# EAGLE board PDNode-600 Pro1 (EAGLE 9.2.1), part 1 of 5
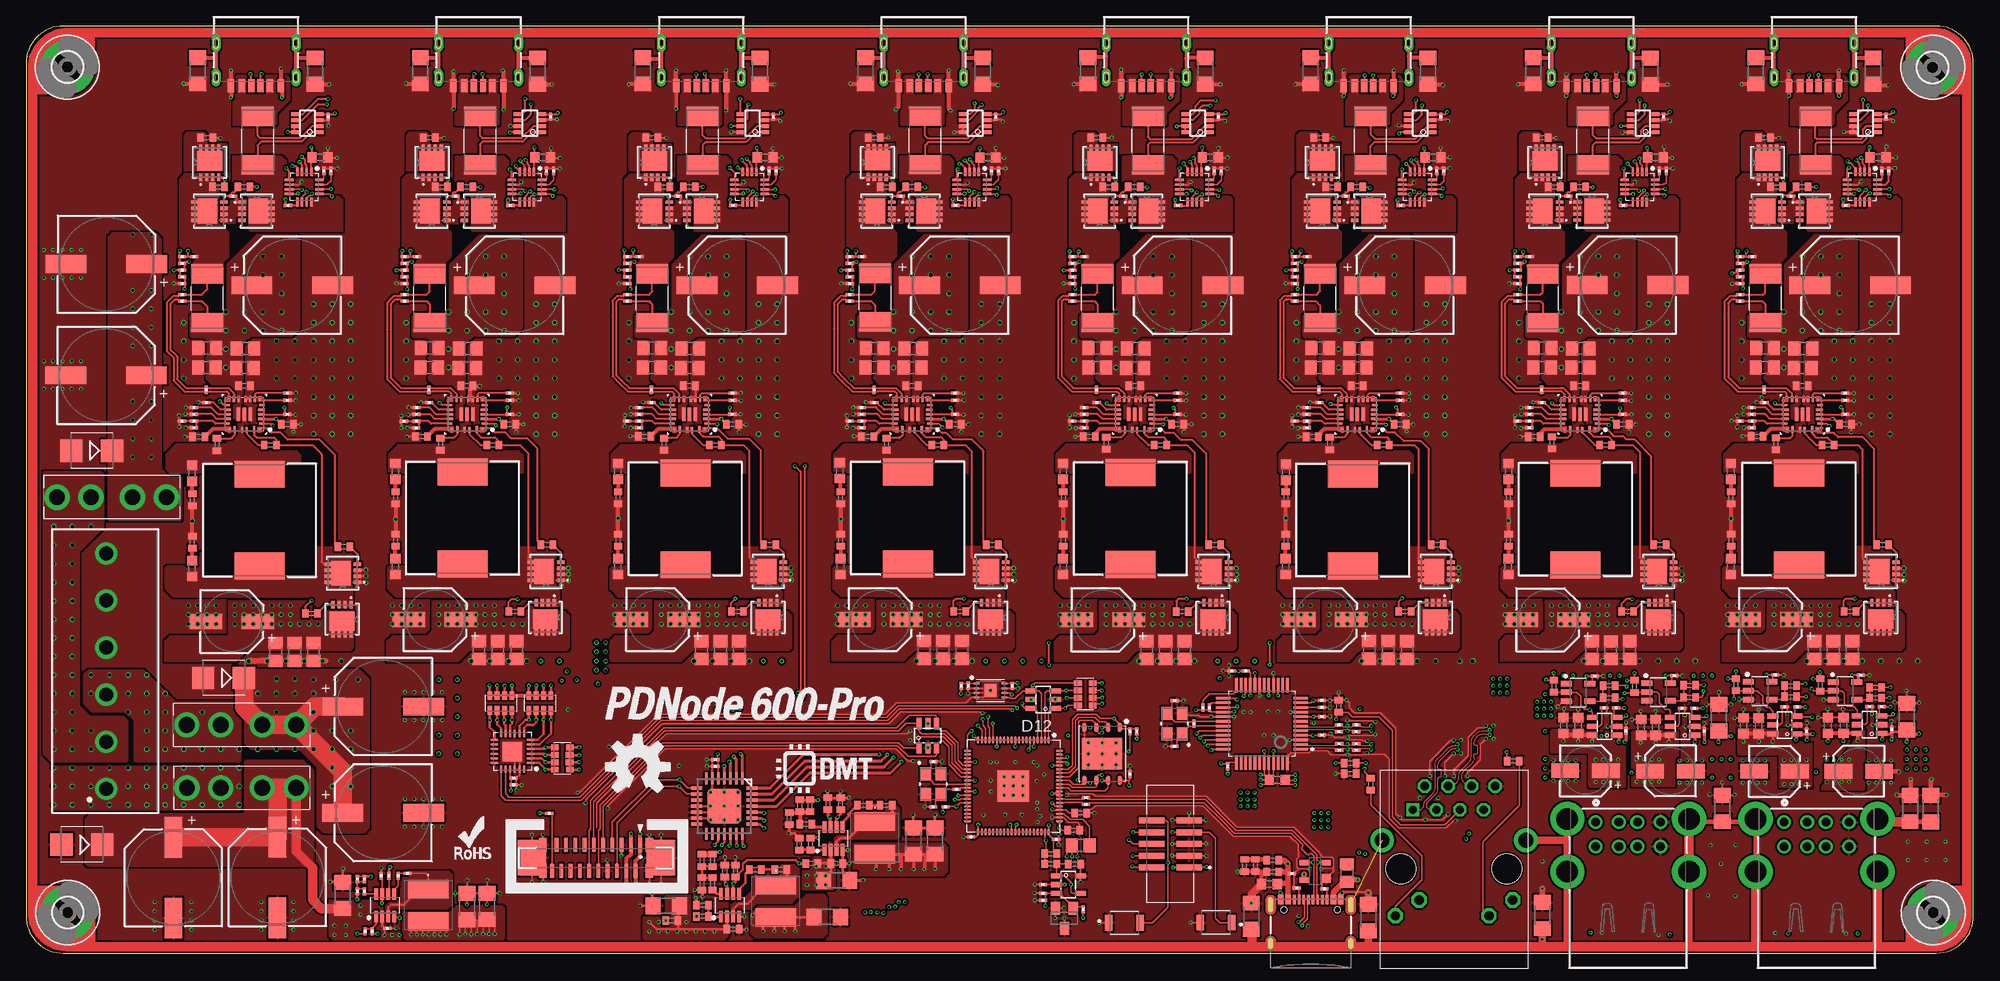
[diagram p15: board, top side]
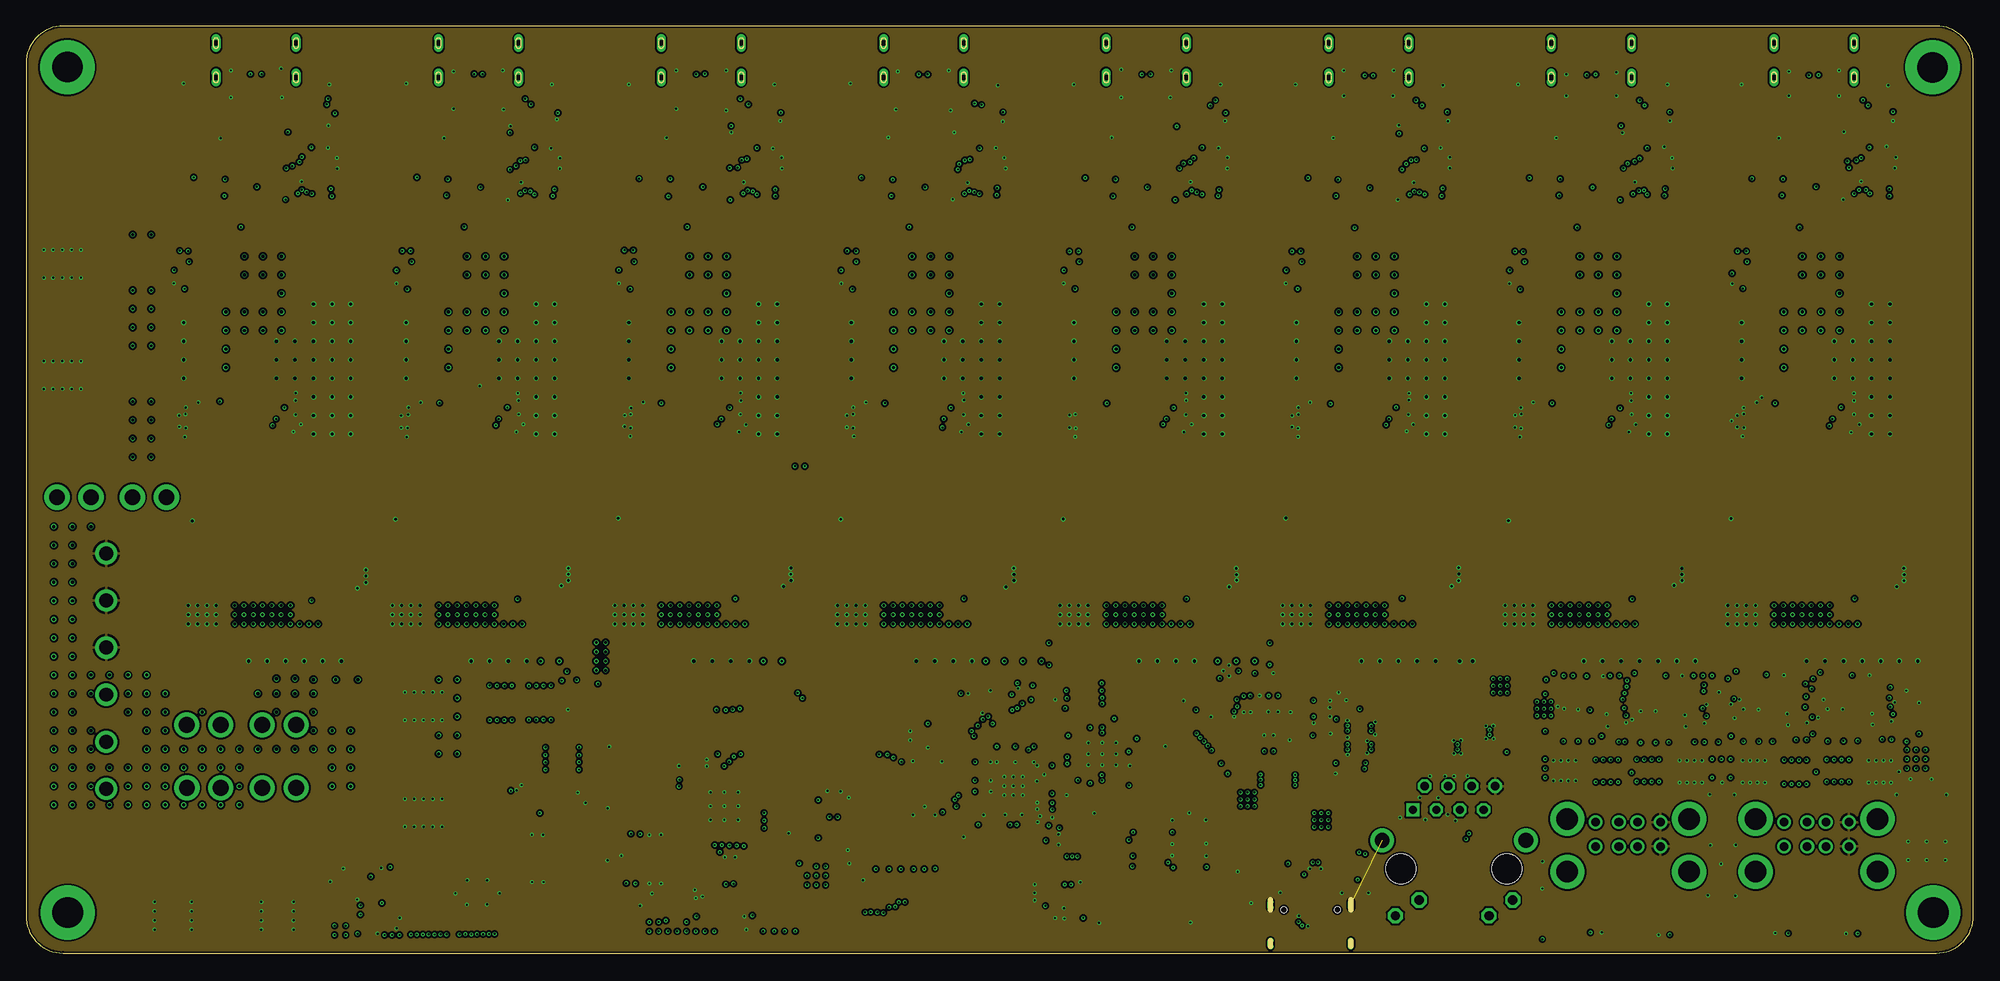
[diagram p16: board, inner layer L2-GND]
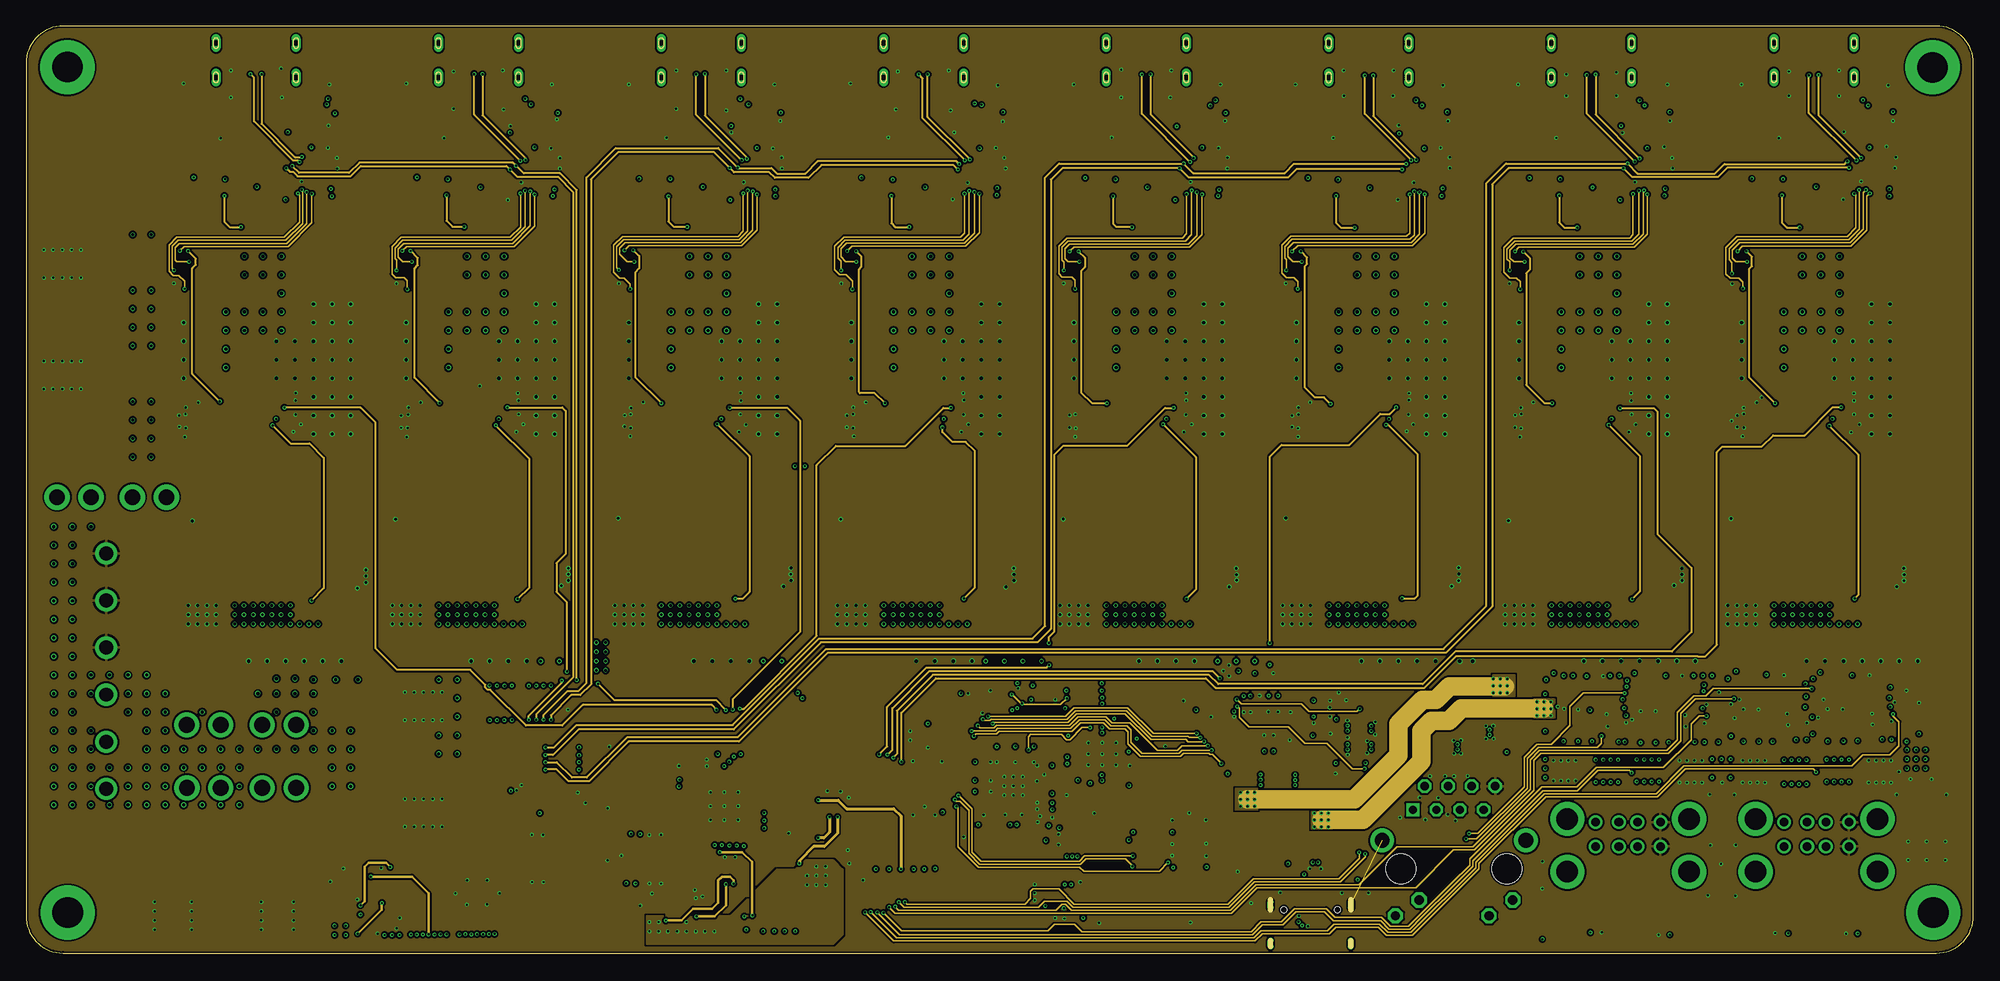
[diagram p17: board, inner layer L3-SIG-LS]
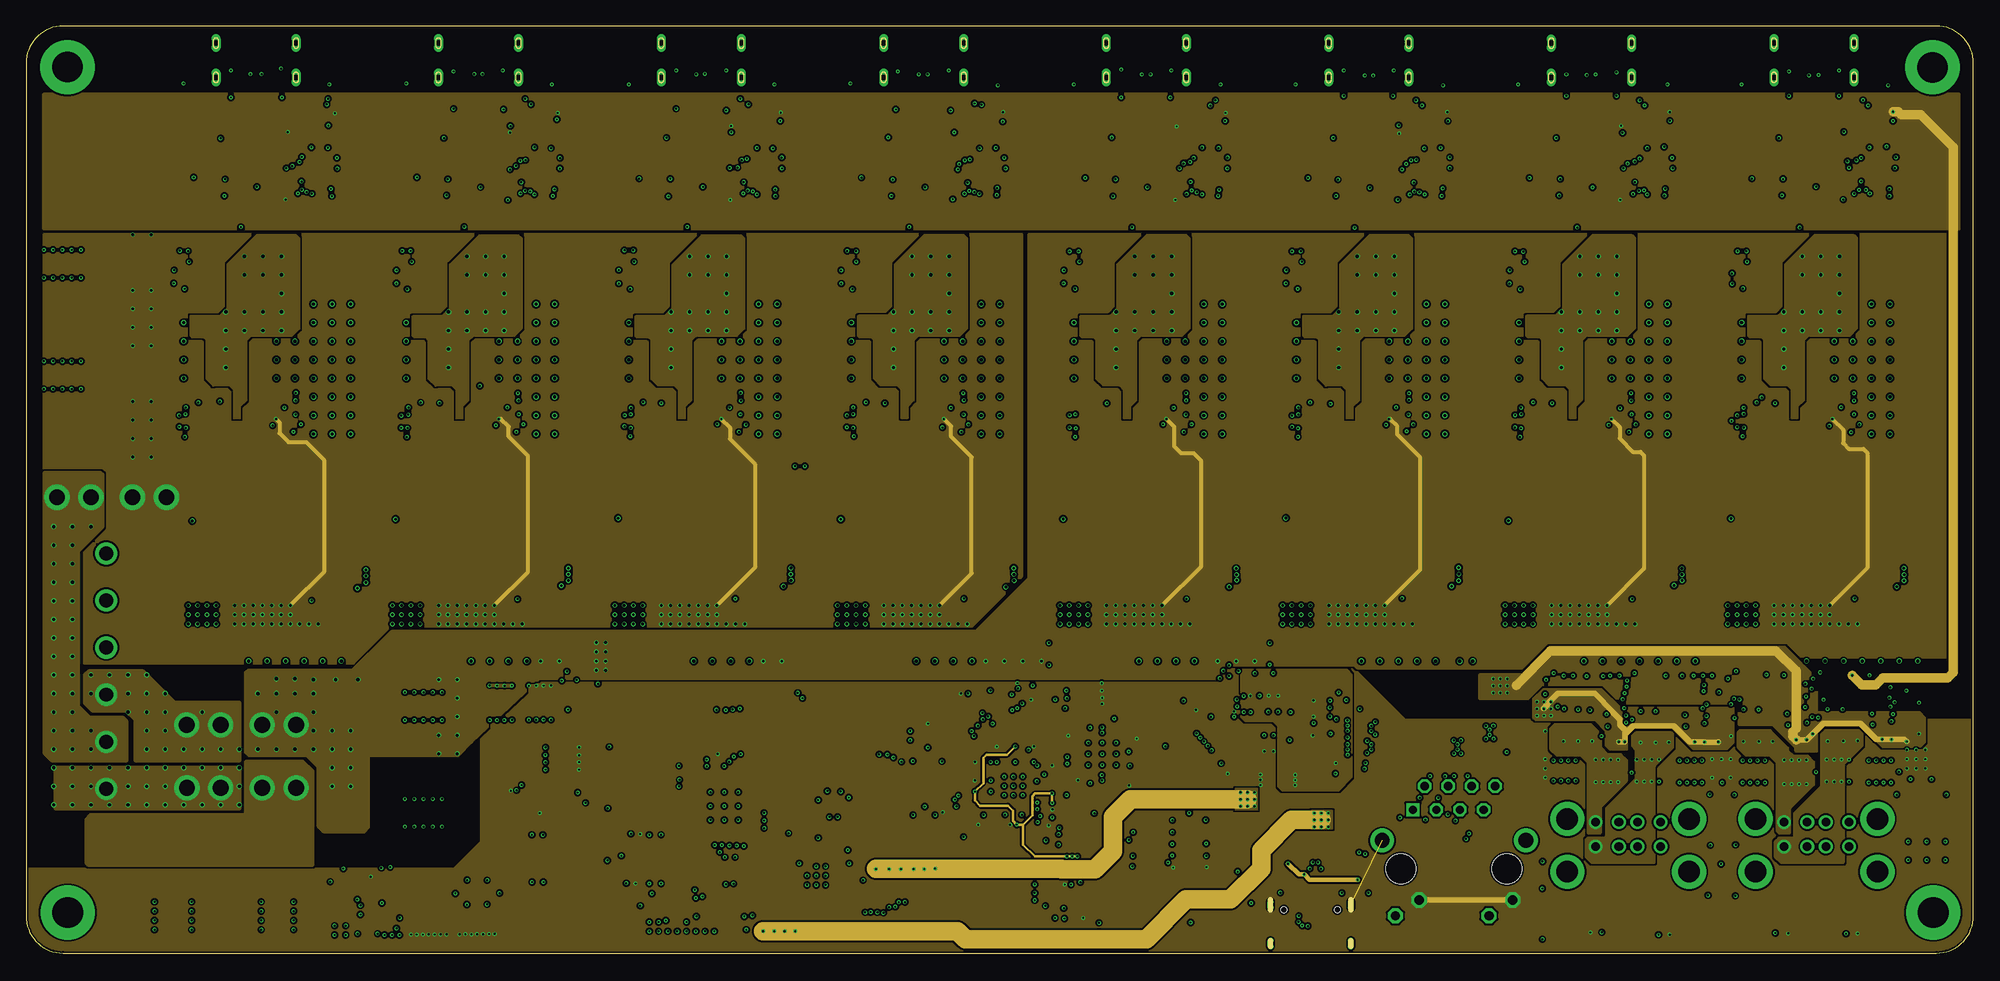
[diagram p18: board, inner layer L4-PWR]
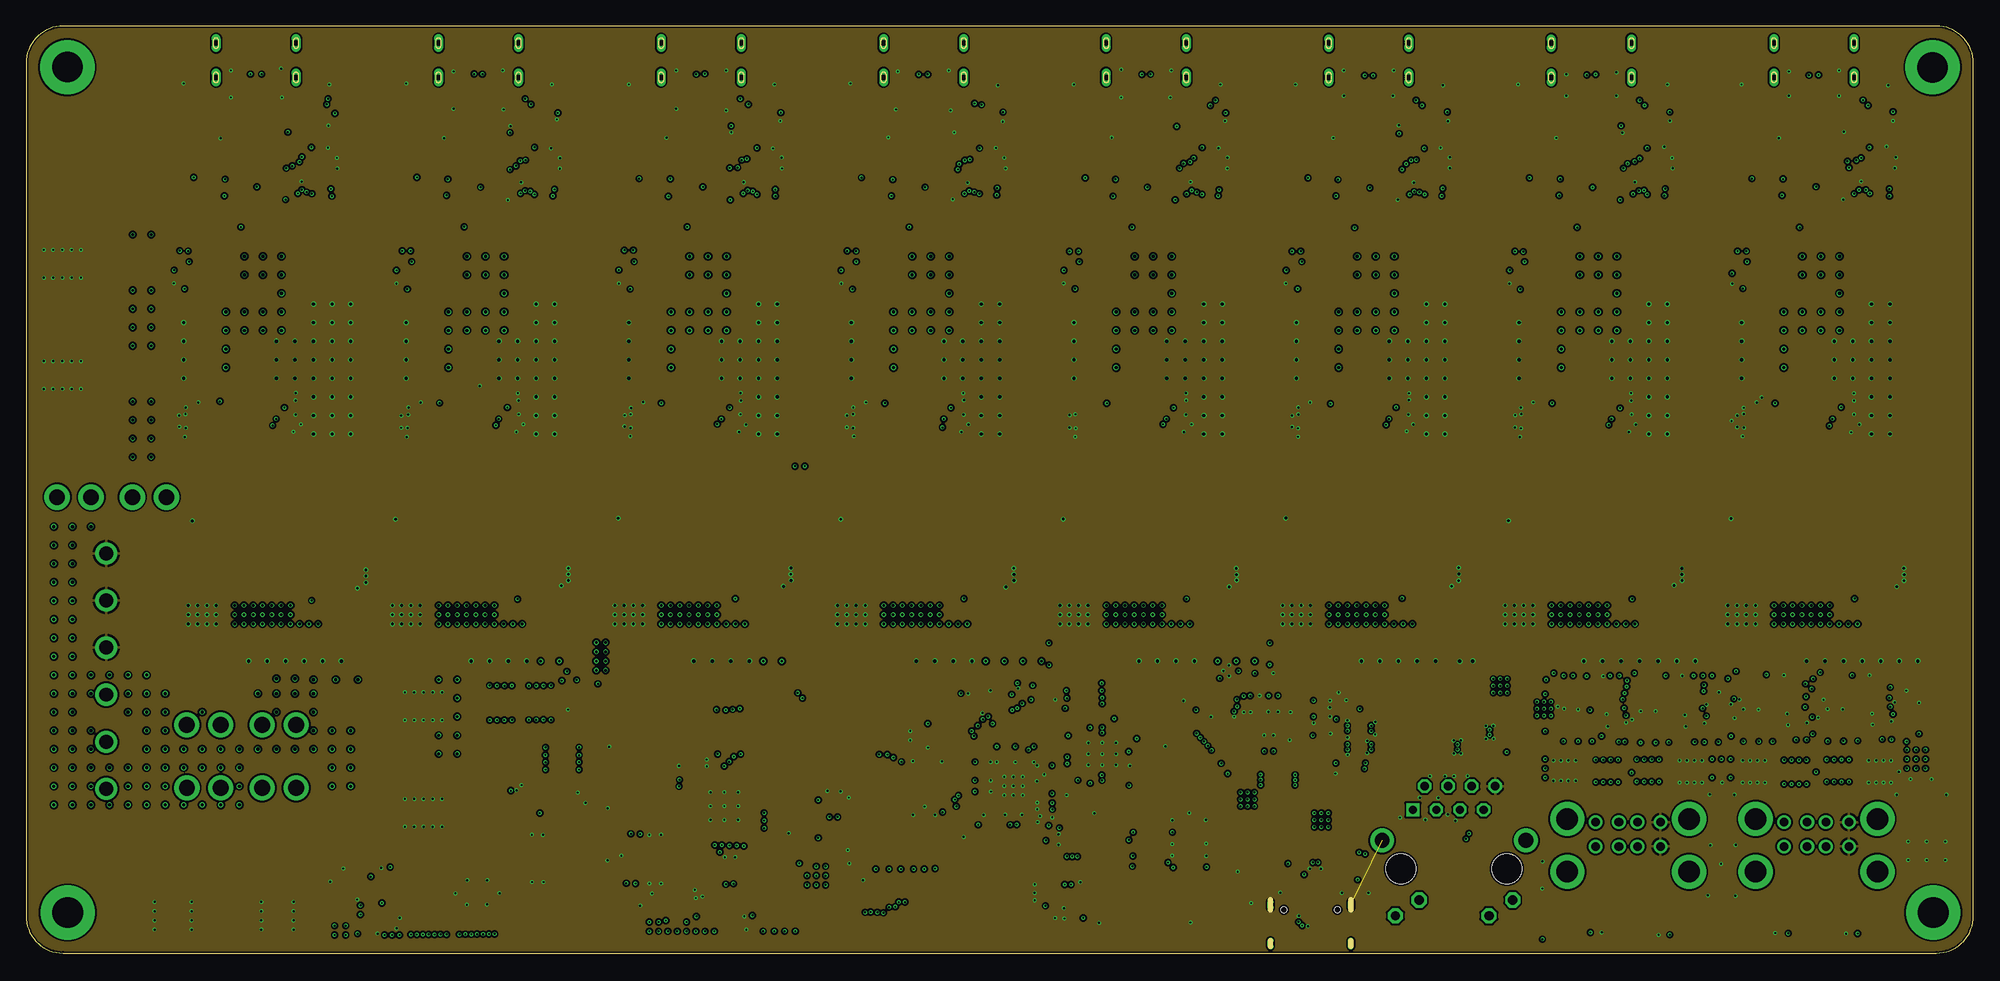
[diagram p19: board, inner layer L5-GND]
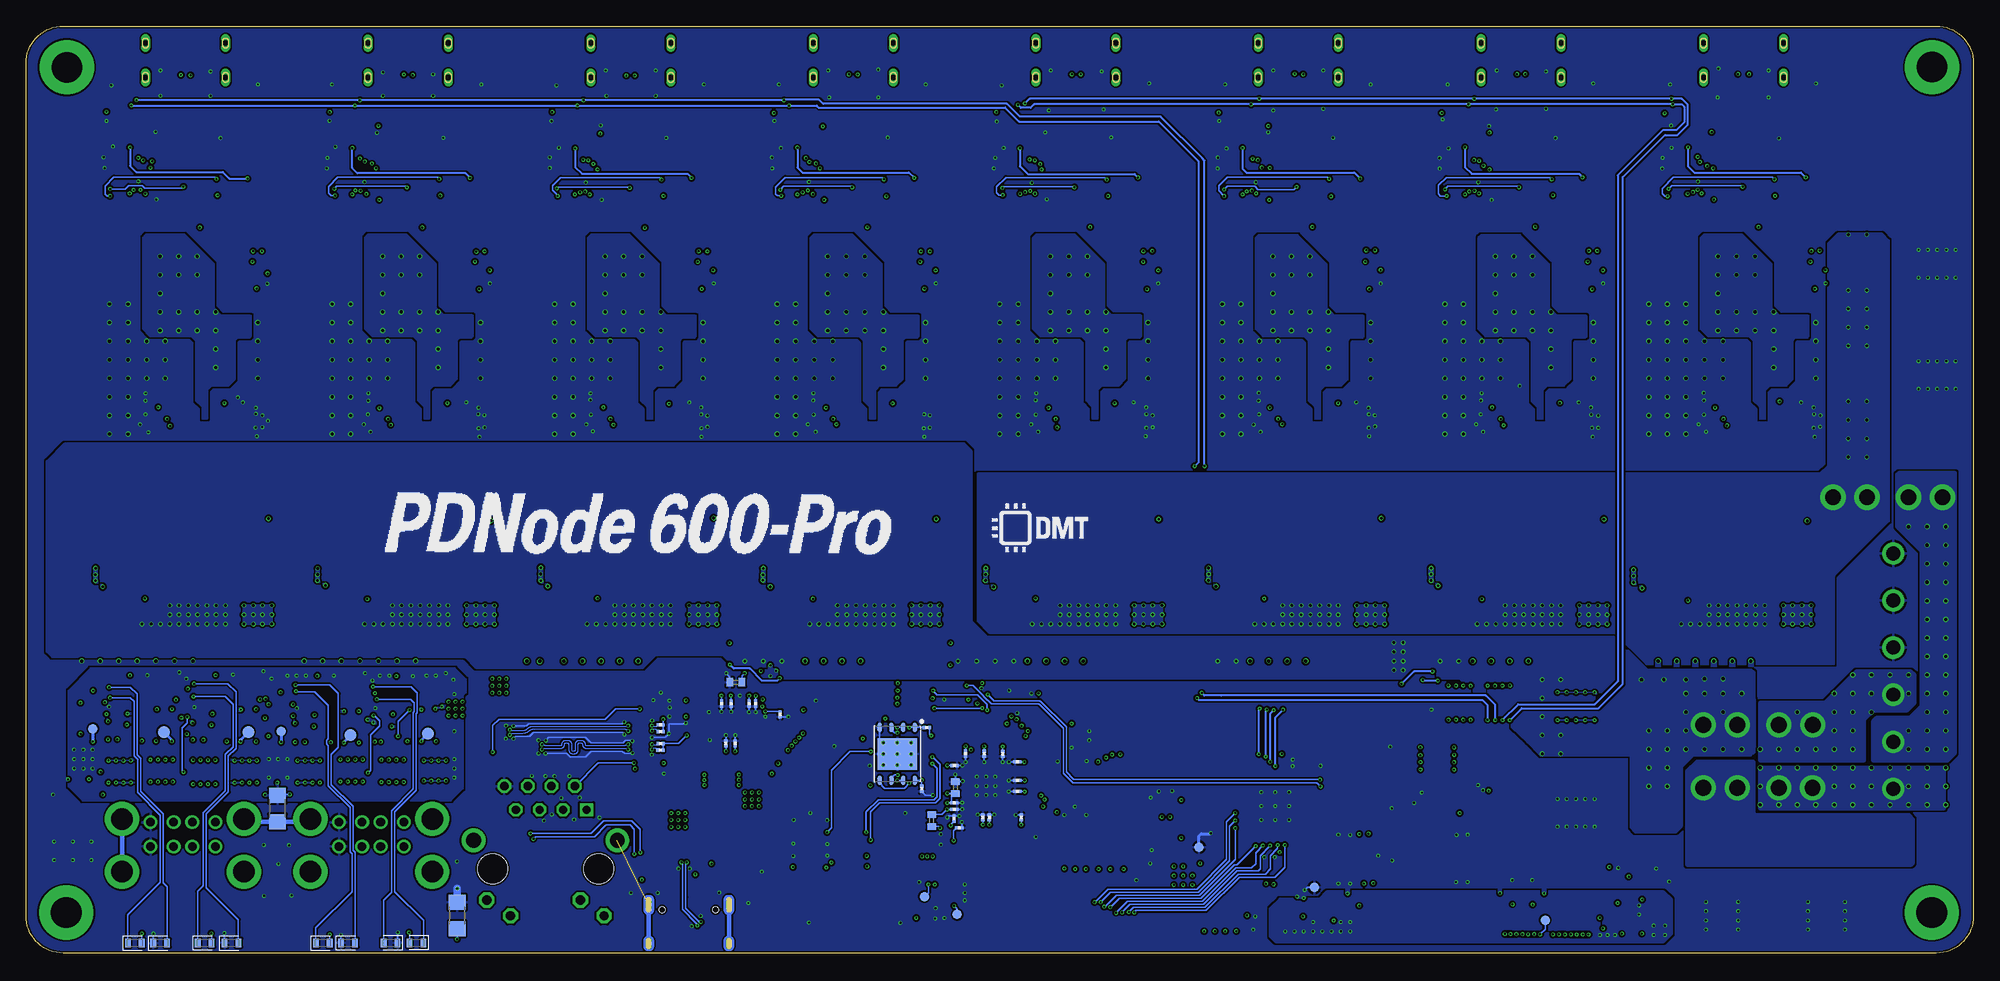
[diagram p20: board, bottom side, seen from below]

Size 210 x 100 mm. Coordinates in mm from the lower left corner, seen from the top.
Outline: 0,96 0,4 arc90 4,0 206,0 arc90 210,4 210,96 arc90 206,100 4,100 arc90 0,96
Copper layers (1+2*3+14*15+16): L1-SIG-HS 0.035mm / dielectric 0.0994mm / L2-GND 0.0152mm / dielectric 0.55mm / L3-SIG-LS 0.0152mm / dielectric 0.1088mm / L4-PWR 0.0152mm / dielectric 0.55mm / L5-GND 0.0152mm / dielectric 0.0994mm / L6-SIG-HS 0.035mm
Design rules "JLC06161H-3313_6-layer_50RSE-85RD-90RD-100RD": minimum track width 3.5mil, minimum drill 0.15mm, track to track 3.5mil, track to pad 3.5mil, pad to pad 3.5mil, via to via 3.5mil, smd to smd 3.5mil, copper to edge 0.2mm, drill to drill 6mil, minimum pad ring 3.5mil, minimum via ring 3.5mil, stop-mask expansion 0.05mm, vias tented up to drill 16mil, thermal gap 10mil
Net classes: 0 50R_SE: width 0.149 mm, drill 0.2 mm, clearance 0.178 mm; 1 100R_DIFFPAIR: width 0.115 mm, drill 0.2 mm, clearance 0.178 mm; 2 90R_DIFFPAIR: width 0.149 mm, drill 0.2 mm, clearance 0.178 mm; 3 50R_DIFFPAIR: width 0.203 mm, drill 0.2 mm, clearance 0.178 mm

## Footprints (pad centres in the part's own frame; a part is rotated, then mirrored left to right if it is on the bottom)
TP-ROUND = smd 1 x 1: TP 0,0
1206 = smd 1.6 x 1.803: 1 -1.422,0; 2 1.422,0
0201 = smd 0.34 x 0.35: 1 -0.275,0; 2 0.275,0
0603 = smd 1 x 1.1: 1 -0.85,0; 2 0.85,0
5X5.5(DXL) = smd 3 x 1.6: 1 2.2,0; 2 -2.2,0
0402 = smd 0.7 x 0.9: 1 -0.65,0; 2 0.65,0
0805 = smd 1.3 x 1.5: 1 -0.95,0; 2 0.95,0
6.3X7.7(DXL) = smd 3.5 x 1.6: 1 2.8,0; 2 -2.8,0
10X10.5(DXL) = smd 4.4 x 1.9: 1 4.35,0; 2 -4.35,0
LED-0603 = smd 0.612 x 0.912: A 0.75,0; C -0.75,0
SMB = smd 2.4 x 2.4: A 2.2,0; C -2.2,0
SOT23-6 = smd 0.55 x 1.2: 1 -0.95,-1.3; 2 0,-1.3; 3 0.95,-1.3; 4 0.95,1.3; 5 0,1.3; 6 -0.95,1.3
FPC20 = smd 0.4 x 1.5: 1 -4.552,-1.362; 2 -4.052,1.438; 3 -3.552,-1.362; 4 -3.052,1.438; 5 -2.552,-1.362; 6 -2.052,1.438; 7 -1.552,-1.362; 8 -1.052,1.438; 9 -0.552,-1.362; 10 -0.052,1.438; 11 0.448,-1.362; 12 0.948,1.438; 13 1.448,-1.362; 14 1.948,1.438; 15 2.448,-1.362; 16 2.948,1.438; 17 3.448,-1.362; 18 3.948,1.438; 19 4.448,-1.362; 20 4.948,1.438 | smd 3.048 x 3.81: Z0 -6.795,0; Z5 7.112,0 | smd 0.8 x 1.5: Z1 -5.552,-1.362; Z2 -5.552,1.438; Z3 5.948,-1.362; Z4 5.948,1.438
SOT143 = smd 1 x 1: 1 -0.75,-1.2 | smd 0.6 x 1: 2 0.95,-1.2; 3 0.95,1.2; 4 -0.95,1.2
J1B1211CCD = drill 0.9 square: 1 -4.445,6.35 | drill 0.9 octagon: 2 -3.175,8.89; 3 -1.905,6.35; 4 -0.635,8.89; 5 0.635,6.35; 6 1.905,8.89; 7 3.175,6.35; 8 4.445,8.89 | drill 1.02 octagon: 9 -6.325,-5.08; 10 -3.758,-3.38; 11 3.758,-5.08; 12 6.325,-3.38 | drill 1.6: 13 -7.75,3.05; 14 7.75,3.05 | hole 3.25: -5.715,0; 5.715,0
FUSE_3544-2 = drill 1.7: 1_1 -5.895,0; 1_2 -2.235,0; 2_1 2.235,0; 2_2 5.895,0
3,3-PAD = drill 3.3 pad 5.842: B3,3 0,0
SOT95P280X145-5N = smd 1.186 x 0.597: 1 -1.264,0.95; 2 -1.264,0; 3 -1.264,-0.95; 4 1.264,-0.95; 5 1.264,0.95
QFN50P300X300X55-16N = smd 0.937 x 0.264: 1 -1.641,0.75; 2 -1.641,0.25; 3 -1.641,-0.25; 4 -1.641,-0.75; 9 1.641,-0.75; 10 1.641,-0.25; 11 1.641,0.25; 12 1.641,0.75 | smd 0.264 x 0.937: 5 -0.75,-1.641; 6 -0.25,-1.641; 7 0.25,-1.641; 8 0.75,-1.641; 13 0.75,1.641; 14 0.25,1.641; 15 -0.25,1.641; 16 -0.75,1.641
RPM0026A-MFG = smd 0.306 x 0.306: 1 -1.661,1.555 | smd 0.6 x 0.25: 2 -1.9,1; 6 -1.9,-1; 14 1.9,-1; 18 1.9,1 | smd 0.725 x 0.25: 3 -1.837,0.5; 4 -1.837,0; 5 -1.837,-0.5; 15 1.837,-0.5; 16 1.837,0; 17 1.837,0.5 | smd 0.29 x 0.29: 7 -1.661,-1.554 | smd 0.25 x 0.625: 8 -1.125,-1.637; 9 -0.625,-1.637; 10 -0.125,-1.637; 11 0.625,-1.637; 12 1.125,-1.637 | smd 0.259 x 0.259: 13 1.644,-1.805 | smd 0.332 x 0.332: 19 1.641,1.591 | smd 0.25 x 0.675: 20 1.05,1.613; 23 -1.05,1.613 | smd 0.25 x 0.6: 21 0.25,1.65; 22 -0.25,1.65 | smd 0.375 x 1.425: 24 -0.625,0; 25 0,0; 26 0.625,0
SOT23-8 = smd 0.45 x 0.8: 1 -0.975,-1.35; 2 -0.325,-1.35; 3 0.325,-1.35; 4 0.975,-1.35; 5 0.975,1.35; 6 0.325,1.35; 7 -0.325,1.35; 8 -0.975,1.35
QFN80-10X10 = smd 0.811 x 0.22: 1 -4.951,3.8; 2 -4.951,3.4; 3 -4.951,3; 4 -4.951,2.6; 5 -4.951,2.2; 6 -4.951,1.8; 7 -4.951,1.4; 8 -4.951,1; 9 -4.951,0.6; 10 -4.951,0.2; 11 -4.951,-0.2; 12 -4.951,-0.6; 13 -4.951,-1; 14 -4.951,-1.4; 15 -4.951,-1.8; 16 -4.951,-2.2; 17 -4.951,-2.6; 18 -4.951,-3; 19 -4.951,-3.4; 20 -4.951,-3.8; 41 4.951,-3.8; 42 4.951,-3.4; 43 4.951,-3; 44 4.951,-2.6; 45 4.951,-2.2; 46 4.951,-1.8; 47 4.951,-1.4; 48 4.951,-1; 49 4.951,-0.6; 50 4.951,-0.2; 51 4.951,0.2; 52 4.951,0.6; 53 4.951,1; 54 4.951,1.4; 55 4.951,1.8; 56 4.951,2.2; 57 4.951,2.6; 58 4.951,3; 59 4.951,3.4; 60 4.951,3.8 | smd 0.22 x 0.811: 21 -3.8,-4.951; 22 -3.4,-4.951; 23 -3,-4.951; 24 -2.6,-4.951; 25 -2.2,-4.951; 26 -1.8,-4.951; 27 -1.4,-4.951; 28 -1,-4.951; 29 -0.6,-4.951; 30 -0.2,-4.951; 31 0.2,-4.951; 32 0.6,-4.951; 33 1,-4.951; 34 1.4,-4.951; 35 1.8,-4.951; 36 2.2,-4.951; 37 2.6,-4.951; 38 3,-4.951; 39 3.4,-4.951; 40 3.8,-4.951; 61 3.8,4.951; 62 3.4,4.951; 63 3,4.951; 64 2.6,4.951; 65 2.2,4.951; 66 1.8,4.951; 67 1.4,4.951; 68 1,4.951; 69 0.6,4.951; 70 0.2,4.951; 71 -0.2,4.951; 72 -0.6,4.951; 73 -1,4.951; 74 -1.4,4.951; 75 -1.8,4.951; 76 -2.2,4.951; 77 -2.6,4.951; 78 -3,4.951; 79 -3.4,4.951; 80 -3.8,4.951 | smd 3.4 x 3.4: 81 0,0
SON127P600X500X75-8N = smd 1.012 x 0.432: 1 -2.85,1.905; 2 -2.85,0.635; 3 -2.85,-0.635; 4 -2.85,-1.905; 5 2.85,-1.905; 6 2.85,-0.635; 7 2.85,0.635; 8 2.85,1.905 | smd 3.4 x 4.3: PAD 0,0
SOT23-5 = smd 0.55 x 1.2: 1 -0.95,-1.3; 2 0,-1.3; 3 0.95,-1.3; 4 0.95,1.3; 5 -0.95,1.3
SON50P300X200X50-9T130X140N = smd 0.711 x 0.27: 1 -1.501,0.75; 2 -1.501,0.25; 3 -1.501,-0.25; 4 -1.501,-0.75; 5 1.501,-0.75; 6 1.501,-0.25; 7 1.501,0.25; 8 1.501,0.75 | smd 1.3 x 1.4: 9 0,0
LQFP48 = smd 1.56 x 0.28: 1 -4.18,2.75; 2 -4.18,2.25; 3 -4.18,1.75; 4 -4.18,1.25; 5 -4.18,0.75; 6 -4.18,0.25; 7 -4.18,-0.25; 8 -4.18,-0.75; 9 -4.18,-1.25; 10 -4.18,-1.75; 11 -4.18,-2.25; 12 -4.18,-2.75; 25 4.18,-2.75; 26 4.18,-2.25; 27 4.18,-1.75; 28 4.18,-1.25; 29 4.18,-0.75; 30 4.18,-0.25; 31 4.18,0.25; 32 4.18,0.75; 33 4.18,1.25; 34 4.18,1.75; 35 4.18,2.25; 36 4.18,2.75 | smd 0.28 x 1.56: 13 -2.75,-4.18; 14 -2.25,-4.18; 15 -1.75,-4.18; 16 -1.25,-4.18; 17 -0.75,-4.18; 18 -0.25,-4.18; 19 0.25,-4.18; 20 0.75,-4.18; 21 1.25,-4.18; 22 1.75,-4.18; 23 2.25,-4.18; 24 2.75,-4.18; 37 2.75,4.18; 38 2.25,4.18; 39 1.75,4.18; 40 1.25,4.18; 41 0.75,4.18; 42 0.25,4.18; 43 -0.25,4.18; 44 -0.75,4.18; 45 -1.25,4.18; 46 -1.75,4.18; 47 -2.25,4.18; 48 -2.75,4.18
QFN50P400X400X100-25T210N = smd 0.86 x 0.264: 1 -1.935,1.25; 2 -1.935,0.75; 3 -1.935,0.25; 4 -1.935,-0.25; 5 -1.935,-0.75; 6 -1.935,-1.25; 13 1.935,-1.25; 14 1.935,-0.75; 15 1.935,-0.25; 16 1.935,0.25; 17 1.935,0.75; 18 1.935,1.25 | smd 0.264 x 0.86: 7 -1.25,-1.935; 8 -0.75,-1.935; 9 -0.25,-1.935; 10 0.25,-1.935; 11 0.75,-1.935; 12 1.25,-1.935; 19 1.25,1.935; 20 0.75,1.935; 21 0.25,1.935; 22 -0.25,1.935; 23 -0.75,1.935; 24 -1.25,1.935 | smd 2.1 x 2.1: 25 0,0
SOT65P280X110-8N = smd 1.259 x 0.4: 1 -1.228,0.975; 2 -1.228,0.325; 3 -1.228,-0.325; 4 -1.228,-0.975; 5 1.228,-0.975; 6 1.228,-0.325; 7 1.228,0.325; 8 1.228,0.975
QFN28[6X6]ML = smd 1.27 x 0.35: 1 -2.985,1.95; 2 -2.985,1.3; 3 -2.985,0.65; 4 -2.985,0; 5 -2.985,-0.65; 6 -2.985,-1.3; 7 -2.985,-1.95; 15 2.985,-1.95; 16 2.985,-1.3; 17 2.985,-0.65; 18 2.985,0; 19 2.985,0.65; 20 2.985,1.3; 21 2.985,1.95 | smd 0.35 x 1.27: 8 -1.95,-2.985; 9 -1.3,-2.985; 10 -0.65,-2.985; 11 0,-2.985; 12 0.65,-2.985; 13 1.3,-2.985; 14 1.95,-2.985; 22 1.95,2.985; 23 1.3,2.985; 24 0.65,2.985; 25 0,2.985; 26 -0.65,2.985; 27 -1.3,2.985; 28 -1.95,2.985 | smd 3.7 x 3.7: PAD 0,0
691244510006 = drill 1.5: 1 -12.7,0; 2 -7.62,0; 3 -2.54,0; 4 2.54,0; 5 7.62,0; 6 12.7,0
3220_10_0300_00 = smd 0.65 x 2.77: 1 -2.54,-2.015; 2 -2.54,2.015; 3 -1.27,-2.015; 4 -1.27,2.015; 5 0,-2.015; 6 0,2.015; 7 1.27,-2.015; 8 1.27,2.015; 9 2.54,-2.015; 10 2.54,2.015
WE-PDHV_1280 = smd 2.9 x 5.4: 1 -4.95,0; 2 4.95,0
SRR5228A = smd 4.4 x 2: 1 0,1.75; 2 0,-1.75
632722100213 = smd 0.7 x 1.4: A5 -0.5,2.75; A9 1.5,2.75; A12 2.7,2.75; B5 0.5,2.75; B9 -1.5,2.75; B12 -2.7,2.75 | drill 0.6 pad 0.7 long: S1 -4.32,1.85; S2 4.32,1.85; S3 4.32,-1.85; S4 -4.32,-1.85
R0201 = smd 0.34 x 0.35: 1 -0.275,0; 2 0.275,0
2512 = smd 2.08 x 3.44: 1 -2.616,0; 2 2.616,0
_0603X4-1206 = smd 0.59 x 0.92: A1 -1.2,-0.8; A2 -1.2,0.8; B1 -0.4,-0.8; B2 -0.4,0.8; C1 0.4,-0.8; C2 0.4,0.8; D1 1.2,-0.8; D2 1.2,0.8
SOT23 = smd 1 x 1.4: 1 -0.95,-1.1; 2 0.95,-1.1; 3 0,1.1
B3U-1000P = smd 0.8 x 1.7: 1 -1.7,0; 2 1.7,0
POWERDI3333-8_UX_DIO-L = smd 0.813 x 0.356: 1 -1.6,0.975; 2 -1.6,0.325; 3 -1.6,-0.325; 4 -1.6,-0.975; 5 1.549,-0.975; 6 1.549,-0.325; 7 1.549,0.325; 8 1.549,0.975 | smd 2.1 x 2.69: 9 0.2,0
USB-C = smd 0.3 x 1: A5 -1.18,3.37; A6 -0.18,3.37; A7 0.32,3.37; A8 1.32,3.37; B5 1.82,3.37; B6 0.82,3.37; B7 -0.68,3.37; B8 -1.68,3.37 | smd 0.6 x 1: GND -3.155,3.37; GND2 3.295,3.37; VBUS1 -2.38,3.37; VBUS2 2.52,3.37 | drill 0.4 pad 0.6 long: SHLD1 -4.248,2.795; SHLD2 4.388,2.795; SHLD3 -4.248,-1.385; SHLD4 4.388,-1.385 | hole 0.65: -2.82,2.265; 2.96,2.265
61400826021 = drill 0.92: 1 -3.5,7.11; 2 -1,7.11; 3 1,7.11; 4 3.5,7.11; 5 -3.5,4.49; 6 -1,4.49; 7 1,4.49; 8 3.5,4.49 | drill 2.3: S1 -6.57,7.46; S2 6.57,7.46; S3 -6.57,1.78; S4 6.57,1.78
B1,27 = smd 1.27 x 1.27: TP 0,0
WE-XTAL_CFPX-180 = smd 1.4 x 1.2: 1 -1.1,-0.85; 2 1.1,-0.85; 3 1.1,0.85; 4 -1.1,0.85

## Placement (x,y rotation side)
AVDD  DNI  [TP-ROUND]  113.12,6.09 90 bottom
C1  1nF 2kV  [1206]  182.92,15.61 90 top
C2  100nF 25V  [0201]  201.18,24.14 90 top
C3  10uF 16V  [0603]  194.29,24.56 90 top
C4  10uF 16V  [0603]  195.99,24.56 90 top
C5  100uF 16V  [5X5.5(DXL)]  197.62,19.61 180 top
C6  1uF 10V  [0201]  200.88,84.38 90 top
C7  100nF 25V  [0201]  172.53,23.98 90 top
C8  10uF 16V  [0603]  165.79,24.55 90 top
C9  10uF 16V  [0603]  167.36,24.55 90 top
C10  100uF 16V  [5X5.5(DXL)]  168.16,19.68 0 top
C11  1nF 2kV  [1206]  205.39,15.6 90 top
C12  100nF 25V  [0201]  180.99,23.94 90 top
C13  10uF 16V  [0603]  174.15,24.36 90 top
C14  10uF 16V  [0603]  175.73,24.36 90 top
C15  100uF 16V  [5X5.5(DXL)]  177.33,19.64 180 top
C16  1uF 10V  [0201]  200.12,84.38 90 top
C17  100nF 25V  [0201]  188.64,30.01 0 top
C18  100nF 25V  [0201]  197.86,29.99 0 top
C19  100nF 25V  [0201]  169.18,29.88 0 top
C20  100nF 25V  [0201]  177.75,29.93 0 top
C21  4.7uF 10V  [0402]  112.97,13.26 0 top
C22  4.7uF 10V  [0402]  113.72,15.12 0 top
C23  100nF 25V  [0201]  108.68,21.52 270 bottom
C24  100nF 25V  [0201]  109.87,20.24 0 bottom
C25  100nF 25V  [0201]  109.9,15.51 0 bottom
C26  4.7uF 10V  [0402]  109.78,17.85 90 bottom
C27  100nF 25V  [0201]  109.9,16.22 0 bottom
C28  1nF 2kV  [1206]  144.75,3.83 90 top
C29  100nF 25V  [0402]  131.4,9.47 270 top
C30  22nF 50V  [0402]  142.78,19.37 180 top
C31  1nF 2kV  [1206]  163.51,4.06 270 bottom
C32  100nF 25V  [0402]  141.55,26.64 90 top
C33  6.8nF 50V  [0201]  143.44,23.89 0 top
C34  6.8nF 50V  [0201]  143.45,24.61 0 top
C35  100nF 25V  [0201]  131.32,26.9 270 bottom
C36  4.7uF 25V  [0402]  133.46,29.22 180 bottom
C37  18pF 50V  [0201]  123.83,22.31 180 top
C38  18pF 50V  [0201]  123.86,27.23 0 top
C39  1uF 50V  [0603]  199.71,85.82 0 top
C40  1nF 2kV  [1206]  199.17,95.13 90 top
C41  4.7uF 25V  [0402]  186.67,55.74 180 top
C42  10nF 50V  [0201]  196.18,59.64 0 top
C43  100pF 50V  [0201]  186.11,56.66 180 top
C44  10nF 50V  [0201]  184.81,57.39 180 top
C45  100nF 50V  [0402]  194.33,54.8 180 top
C46  100nF 50V  [0402]  188.69,54.92 90 top
C47  10uF 50V  [0805]  194.88,32.7 270 top
C48  10uF 50V  [0805]  196.92,32.7 270 top
C49  1uF 50V  [0805]  192.84,32.7 270 top
C50  100uF 50V  [6.3X7.7(DXL)]  188.11,35.98 0 top
C51  1uF 50V  [0402]  191.54,61.19 0 top
C52  10uF 50V  [0805]  187.5,63.15 180 top
C53  10uF 50V  [0805]  187.54,65.25 180 top
C54  10uF 50V  [0805]  191.59,63.13 0 top
C55  100nF 25V  [0201]  200.58,90.23 270 top
C56  1uF 10V  [0201]  176.88,84.38 90 top
C57  1uF 10V  [0201]  176.12,84.38 90 top
C58  1uF 50V  [0603]  175.71,85.82 0 top
C59  4.7uF 25V  [0402]  162.61,55.71 180 top
C60  10nF 50V  [0201]  172.18,59.64 0 top
C61  100pF 50V  [0201]  162.11,56.66 180 top
C62  10nF 50V  [0201]  160.81,57.39 180 top
C63  100nF 50V  [0402]  170.33,54.8 180 top
C64  100nF 50V  [0402]  164.54,55.05 90 top
C65  10uF 50V  [0805]  168.83,32.7 270 top
C66  10uF 50V  [0805]  172.92,32.7 270 top
C67  1uF 50V  [0805]  170.88,32.69 270 top
C68  100uF 50V  [6.3X7.7(DXL)]  164.1,35.96 0 top
C69  1uF 50V  [0402]  167.54,61.19 0 top
C70  10uF 50V  [0805]  167.65,65.23 0 top
C71  10uF 50V  [0805]  163.54,65.25 180 top
C72  10uF 50V  [0805]  167.6,63.14 0 top
C73  100nF 25V  [0201]  176.58,90.23 270 top
C74  100nF 25V  [0201]  163.43,60.77 270 top
C75  1uF 50V  [0402]  172.19,57.05 0 top
C76  2.2nF 50V  [0402]  159.86,44.55 90 top
C77  2.2nF 50V  [0402]  159.86,49.12 270 top
C78  10uF 50V  [0805]  163.5,63.15 180 top
C79  330uF 50V  [10X10.5(DXL)]  172.69,72.05 180 top
C80  1nF 2kV  [1206]  175.16,95.12 90 top
C81  1uF 10V  [0201]  152.88,84.38 90 top
C82  100nF 25V  [0201]  192.01,23.92 90 top
C83  10uF 16V  [0603]  185.2,24.52 90 top
C84  10uF 16V  [0603]  186.82,24.5 90 top
C85  100uF 16V  [5X5.5(DXL)]  188.55,19.63 0 top
C86  1uF 10V  [0201]  152.12,84.38 90 top
C87  1uF 50V  [0603]  151.71,85.82 0 top
C88  4.7uF 25V  [0402]  138.68,55.69 180 top
C89  10nF 50V  [0201]  148.19,59.64 0 top
C90  100pF 50V  [0201]  138.12,56.66 180 top
C91  10nF 50V  [0201]  136.81,57.39 180 top
C92  100nF 50V  [0402]  146.33,54.8 180 top
C93  100nF 50V  [0402]  140.57,54.97 90 top
C94  10uF 50V  [0805]  148.92,32.7 270 top
C95  10uF 50V  [0805]  146.88,32.71 270 top
C96  1uF 50V  [0805]  144.83,32.71 270 top
C97  100uF 50V  [6.3X7.7(DXL)]  140.11,35.98 0 top
C98  1uF 50V  [0402]  143.54,61.19 0 top
C99  10uF 50V  [0805]  143.59,63.14 0 top
C100  10uF 50V  [0805]  143.65,65.21 0 top
C101  10uF 50V  [0805]  139.5,63.15 180 top
C102  100nF 25V  [0201]  152.58,90.23 270 top
C103  100nF 25V  [0201]  139.43,60.77 270 top
C104  1uF 50V  [0402]  148.19,57.05 0 top
C105  2.2nF 50V  [0402]  135.85,44.55 90 top
C106  2.2nF 50V  [0402]  135.85,49.12 270 top
C107  10uF 50V  [0805]  139.54,65.25 180 top
C108  330uF 50V  [10X10.5(DXL)]  148.7,72.04 180 top
C109  1nF 2kV  [1206]  151.18,95.14 90 top
C110  1uF 10V  [0201]  128.88,84.38 90 top
C111  1uF 10V  [0201]  128.12,84.38 90 top
C112  1uF 50V  [0603]  127.71,85.82 0 top
C113  4.7uF 25V  [0402]  114.65,55.72 180 top
C114  10nF 50V  [0201]  124.18,59.63 0 top
C115  100pF 50V  [0201]  114.11,56.66 180 top
C116  10nF 50V  [0201]  112.81,57.39 180 top
C117  100nF 50V  [0402]  122.33,54.8 180 top
C118  100nF 50V  [0402]  116.48,54.98 90 top
C119  10uF 50V  [0805]  120.84,32.7 270 top
C120  10uF 50V  [0805]  122.87,32.7 270 top
C121  1uF 50V  [0805]  124.92,32.7 270 top
C122  100uF 50V  [6.3X7.7(DXL)]  116.12,35.97 0 top
C123  1uF 50V  [0402]  119.54,61.19 0 top
C124  10uF 50V  [0805]  119.59,63.13 0 top
C125  10uF 50V  [0805]  119.65,65.22 0 top
C126  10uF 50V  [0805]  115.5,63.15 180 top
C127  100nF 25V  [0201]  128.58,90.22 270 top
C128  100nF 25V  [0201]  115.43,60.77 270 top
C129  1uF 50V  [0402]  124.19,57.05 0 top
C130  2.2nF 50V  [0402]  111.84,44.55 90 top
C131  2.2nF 50V  [0402]  111.86,49.11 270 top
C132  10uF 50V  [0805]  115.54,65.25 180 top
C133  330uF 50V  [10X10.5(DXL)]  124.72,72.02 180 top
C134  1nF 2kV  [1206]  127.16,95.14 90 top
C135  1uF 10V  [0201]  104.88,84.38 90 top
C136  1uF 10V  [0201]  104.12,84.38 90 top
C137  1uF 50V  [0603]  103.71,85.81 0 top
C138  4.7uF 25V  [0402]  90.74,55.73 180 top
C139  10nF 50V  [0201]  100.18,59.64 0 top
C140  100pF 50V  [0201]  90.11,56.66 180 top
C141  10nF 50V  [0201]  88.81,57.39 180 top
C142  100nF 50V  [0402]  98.33,54.8 180 top
C143  100nF 50V  [0402]  92.79,54.91 90 top
C144  10uF 50V  [0805]  98.87,32.71 270 top
C145  10uF 50V  [0805]  96.83,32.71 270 top
C146  1uF 50V  [0805]  100.92,32.71 270 top
C147  100uF 50V  [6.3X7.7(DXL)]  92.1,35.98 0 top
C148  1uF 50V  [0402]  95.54,61.19 0 top
C149  10uF 50V  [0805]  95.66,65.22 0 top
C150  10uF 50V  [0805]  91.5,63.15 180 top
C151  10uF 50V  [0805]  91.54,65.24 180 top
C152  100nF 25V  [0201]  104.58,90.23 270 top
C153  100nF 25V  [0201]  91.43,60.77 270 top
C154  1uF 50V  [0402]  100.19,57.05 0 top
C155  2.2nF 50V  [0402]  87.85,44.55 90 top
C156  2.2nF 50V  [0402]  87.85,49.12 270 top
C157  10uF 50V  [0805]  95.6,63.14 0 top
C158  330uF 50V  [10X10.5(DXL)]  100.7,72.04 180 top
C159  1nF 2kV  [1206]  103.17,95.13 90 top
C160  1uF 10V  [0201]  80.88,84.38 90 top
C161  1uF 10V  [0201]  80.12,84.38 90 top
C162  1uF 50V  [0603]  79.71,85.82 0 top
C163  4.7uF 25V  [0402]  66.7,55.74 180 top
C164  10nF 50V  [0201]  76.18,59.63 0 top
C165  100pF 50V  [0201]  66.11,56.66 180 top
C166  10nF 50V  [0201]  64.81,57.39 180 top
C167  100nF 50V  [0402]  74.33,54.8 180 top
C168  100nF 50V  [0402]  68.8,54.91 90 top
C169  10uF 50V  [0805]  72.84,32.7 270 top
C170  10uF 50V  [0805]  74.88,32.7 270 top
C171  1uF 50V  [0805]  76.91,32.7 270 top
C172  100uF 50V  [6.3X7.7(DXL)]  68.11,35.98 0 top
C173  1uF 50V  [0402]  71.54,61.19 0 top
C174  10uF 50V  [0805]  67.54,65.25 180 top
C175  10uF 50V  [0805]  71.65,65.22 0 top
C176  100nF 25V  [0201]  119.04,19.32 90 top
C177  15pF 50V  [0201]  97.87,20.67 0 top
C178  15pF 50V  [0201]  97.81,15.78 180 top
C179  1uF 10V  [0201]  109.66,5.7 180 top
C180  100nF 25V  [0201]  109.66,6.45 180 top
C181  100nF 25V  [0402]  113.06,9.61 0 top
C182  100nF 25V  [0201]  109.66,7.4 180 top
C183  100nF 25V  [0201]  106.34,28.83 270 top
C184  100nF 25V  [0201]  111.08,12.28 0 top
C185  100nF 25V  [0201]  101.91,12.54 180 top
C186  100nF 25V  [0201]  104.68,21.5 270 bottom
C187  100nF 25V  [0201]  109.94,14.51 90 bottom
C188  100nF 25V  [0201]  106.12,14.64 90 bottom
C189  100nF 25V  [0201]  102.68,14.64 90 bottom
C190  100nF 25V  [0201]  103.1,18.64 180 bottom
C191  100nF 25V  [0201]  109.37,13.51 0 bottom
C192  100nF 25V  [0201]  106.68,21.52 270 bottom
C193  100nF 25V  [0201]  103.1,17.44 180 bottom
C194  100nF 25V  [0201]  106.82,14.64 90 bottom
C195  100nF 25V  [0201]  103.1,20.63 180 bottom
C196  100nF 25V  [0201]  187.43,60.77 270 top
C197  10uF 50V  [0805]  71.59,63.13 0 top
C198  100nF 25V  [0201]  80.58,90.23 270 top
C199  100nF 25V  [0201]  67.43,60.77 270 top
C200  1uF 50V  [0402]  76.19,57.05 0 top
C201  2.2nF 50V  [0402]  63.85,44.55 90 top
C202  2.2nF 50V  [0402]  63.85,49.12 270 top
C203  10uF 50V  [0805]  67.5,63.16 180 top
C204  330uF 50V  [10X10.5(DXL)]  76.7,72.03 180 top
C205  1nF 2kV  [1206]  79.15,95.13 90 top
C206  1uF 10V  [0201]  56.88,84.38 90 top
C207  1uF 10V  [0201]  56.12,84.38 90 top
C208  1uF 50V  [0603]  55.71,85.82 0 top
C209  4.7uF 25V  [0402]  42.62,55.72 180 top
C210  10nF 50V  [0201]  52.18,59.64 0 top
C211  100pF 50V  [0201]  42.08,56.64 180 top
C212  100nF 25V  [0201]  52.58,18.89 0 top
C213  1uF 10V  [0201]  52.58,18.15 0 top
C214  1uF 50V  [0402]  196.19,57.05 0 top
C215  2.2nF 50V  [0402]  183.85,44.55 90 top
C216  2.2nF 50V  [0402]  183.85,49.12 270 top
C217  10uF 50V  [0805]  191.65,65.22 0 top
C218  330uF 50V  [10X10.5(DXL)]  196.71,72.03 180 top
C219  10nF 50V  [0201]  40.75,57.37 180 top
C220  100nF 50V  [0402]  50.33,54.8 180 top
C221  100nF 25V  [0201]  128.7,25.75 270 bottom
C222  100nF 25V  [0201]  133.53,22.63 90 bottom
C223  100nF 25V  [0201]  134.53,22.63 90 bottom
C224  100nF 25V  [0201]  139.74,27.25 0 top
C225  100nF 25V  [0201]  135,26.9 270 bottom
C226  100nF 25V  [0201]  133.98,26.9 270 bottom
C227  100nF 25V  [0201]  132.04,26.9 270 bottom
C228  100nF 25V  [0201]  139.74,25.51 0 top
C229  100nF 25V  [0201]  139.74,23.52 0 top
C230  100nF 50V  [0402]  44.69,54.9 90 top
C231  10uF 50V  [0805]  50.88,32.7 270 top
C232  10uF 50V  [0805]  48.84,32.7 270 top
C233  100nF 25V  [0201]  38.97,2.67 0 top
C234  100nF  [0201]  38.3,8.33 90 top
C235  100nF 25V  [0201]  41.16,8.6 0 top
C236  33pF 50V  [0201]  35.73,7.99 270 top
C237  22uF 25V  [1206]  34.15,6.23 90 top
C238  22uF 25V  [1206]  47.56,5.03 90 top
C239  22uF 25V  [1206]  49.72,5.04 90 top
C240  1uF 50V  [0805]  52.92,32.7 270 top
C241  100uF 50V  [6.3X7.7(DXL)]  44.11,35.98 0 top
C242  1uF 50V  [0402]  47.54,61.19 0 top
C243  10uF 50V  [0805]  43.5,63.15 180 top
C244  10uF 50V  [0805]  43.54,65.25 180 top
C245  10uF 50V  [0805]  47.65,65.22 0 top
C246  100nF 25V  [0201]  56.58,90.23 270 top
C247  10uF 16V  [0603]  134.08,7.45 180 top
C248  100nF 25V  [0402]  134.43,8.77 180 top
C249  100nF 25V  [0201]  74.32,20.14 180 top
C250  100nF 25V  [0201]  43.43,60.77 270 top
C251  1uF 10V  [0201]  74.32,20.87 180 top
C252  330uF 50V  [10X10.5(DXL)]  27.12,8.16 90 top
C253  330uF 50V  [10X10.5(DXL)]  15.9,8.13 90 top
C254  330uF 50V  [10X10.5(DXL)]  8.66,74.32 0 top
C255  330uF 50V  [10X10.5(DXL)]  8.63,62.32 0 top
C256  330uF 50V  [10X10.5(DXL)]  38.52,26.6 180 top
C257  330uF 50V  [10X10.5(DXL)]  38.51,15.13 180 top
C258  1uF 50V  [0402]  52.19,57.05 0 top
C259  2.2nF 50V  [0402]  39.85,44.55 90 top
C260  2.2nF 50V  [0402]  39.85,49.12 270 top
C261  10uF 50V  [0805]  47.59,63.13 0 top
C262  330uF 50V  [10X10.5(DXL)]  52.7,72.02 180 top
C263  1nF 2kV  [1206]  55.17,95.13 90 top
C264  22uF 25V  [1206]  202.8,25.52 90 top
C265  1uF 10V  [0201]  32.88,84.38 90 top
C266  1uF 10V  [0201]  32.12,84.38 90 top
C267  1uF 50V  [0603]  31.71,85.82 0 top
C268  4.7uF 25V  [0402]  18.62,55.69 180 top
C269  10nF 50V  [0201]  28.18,59.64 0 top
C270  100pF 50V  [0201]  18.11,56.66 180 top
C271  10nF 50V  [0201]  16.81,57.39 180 top
C272  100nF 50V  [0402]  26.33,54.8 180 top
C273  100nF 50V  [0402]  20.6,54.86 90 top
C274  10uF 50V  [0805]  26.92,32.49 270 top
C275  10uF 50V  [0805]  28.96,32.49 270 top
C276  1uF 50V  [0805]  31,32.49 270 top
C277  100uF 50V  [6.3X7.7(DXL)]  22.19,35.77 0 top
C278  22uF 25V  [1206]  182.55,25.41 90 top
C279  1uF 50V  [0402]  23.54,61.19 0 top
C280  10uF 50V  [0805]  23.65,65.22 0 top
C281  10uF 50V  [0805]  23.59,63.13 0 top
C282  10uF 50V  [0805]  19.54,65.25 180 top
C283  100nF 25V  [0201]  32.58,90.23 270 top
C284  100nF 25V  [0201]  19.43,60.77 270 top
C285  1uF 50V  [0402]  28.19,57.05 0 top
C286  2.2nF 50V  [0402]  17.93,44.34 90 top
C287  2.2nF 50V  [0402]  17.93,48.91 270 top
C288  10uF 50V  [0805]  19.5,63.15 180 top
C289  330uF 50V  [10X10.5(DXL)]  28.71,72.03 180 top
C290  1nF 2kV  [1206]  31.17,95.13 90 top
C291  100nF 25V  [0201]  113.41,17.74 270 bottom
C292  100nF 25V  [0402]  87.41,9.68 0 top
C293  100nF 25V  [0402]  86.47,16.11 90 top
C294  100nF 25V  [0402]  92.74,15.95 0 top
C295  33pF 50V  [0402]  83.44,15.89 270 top
C296  22uF 25V  [1206]  87.41,7.87 0 top
C297  22uF 25V  [1206]  95.71,12.1 90 top
C298  22uF 25V  [1206]  98.02,12.1 90 top
C299  100nF 25V  [0402]  76.24,2.58 0 top
C300  100nF 25V  [0402]  75.36,8.86 90 top
C301  100nF 25V  [0402]  81.41,9.02 0 top
C302  33pF 50V  [0402]  74.04,10.01 270 top
C303  22uF 25V  [1206]  69.03,5.12 180 top
C304  22uF 25V  [1206]  86.42,3.9 0 top
D1  Green  [LED-0603]  190.74,1.11 0 bottom
D2  Red  [LED-0603]  187.85,1.1 0 bottom
D3  Green  [LED-0603]  198.27,1.09 0 bottom
D4  Red  [LED-0603]  195.54,1.09 0 bottom
D5  Green  [LED-0603]  167.9,1.11 180 bottom
D6  Red  [LED-0603]  170.69,1.1 180 bottom
D7  Green  [LED-0603]  178,1.09 0 bottom
D8  Red  [LED-0603]  175.28,1.11 0 bottom
D9  SMBJ33A  [SMB]  6.01,11.7 180 top
D10  SMBJ33A  [SMB]  7.07,54.2 180 top
D11  SMBJ33A  [SMB]  21.31,29.69 180 top
D12  [SOT23-6]  109.68,27.35 90 top
D13  [SOT23-6]  97.25,23.46 0 top
DISP  AFC11-S20ICC-00  [FPC20]  61.67,10.3 180 top
ESD1  SP0503BAHTG  [SOT143]  139.02,8.82 90 top
ETH1  J1B1211CCD  [J1B1211CCD]  153.99,9.11 0 top
F1  2A  [FUSE_3544-2]  23.24,17.84 0 top
F2  15A  [FUSE_3544-2]  9.24,49.18 0 top
F3  15A  [FUSE_3544-2]  23.23,24.62 0 top
GND-1  DNI  [TP-ROUND]  71.07,7.09 0 bottom
GND-5  DNI  [TP-ROUND]  83.5,11.44 90 bottom
H1  MOUNT-PAD-ROUND3.3  [3,3-PAD]  205.66,4.38 0 top
H2  MOUNT-PAD-ROUND3.3  [3,3-PAD]  4.5,4.38 0 top
H3  MOUNT-PAD-ROUND3.3  [3,3-PAD]  4.46,95.57 0 top
H4  MOUNT-PAD-ROUND3.3  [3,3-PAD]  205.59,95.55 0 top
IC1  AP22653W6  [SOT23-6]  198.79,24.65 90 top
IC2  AP22653W6  [SOT23-6]  170.22,24.46 90 top
IC3  AP22653W6  [SOT23-6]  178.62,24.46 90 top
IC4  SN74LVC1G04DBVR  [SOT95P280X145-5N]  186.97,28.31 0 top
IC5  SN74LVC1G04DBVR  [SOT95P280X145-5N]  196.14,28.29 0 top
IC6  SN74LVC1G04DBVR  [SOT95P280X145-5N]  167.36,28.13 0 top
IC7  SN74LVC1G04DBVR  [SOT95P280X145-5N]  176.03,28.16 0 top
IC8  AP22653W6  [SOT23-6]  189.65,24.61 90 top
IC9  STUSB4710AQ1TR  [QFN50P300X300X55-16N]  198.02,82.64 270 top
IC10  TPS552882  [RPM0026A-MFG]  167.56,58.12 180 top
IC11  INA219BIDCNT  [SOT23-8]  174.35,89.52 90 top
IC12  TPS552882  [RPM0026A-MFG]  191.55,58.12 180 top
IC13  INA219BIDCNT  [SOT23-8]  198.35,89.52 90 top
IC14  STUSB4710AQ1TR  [QFN50P300X300X55-16N]  174.02,82.64 270 top
IC15  TPS552882  [RPM0026A-MFG]  143.55,58.12 180 top
IC16  INA219BIDCNT  [SOT23-8]  150.35,89.52 90 top
IC17  STUSB4710AQ1TR  [QFN50P300X300X55-16N]  150.02,82.64 270 top
IC18  TPS552882  [RPM0026A-MFG]  119.55,58.12 180 top
IC19  INA219BIDCNT  [SOT23-8]  126.35,89.52 90 top
IC20  STUSB4710AQ1TR  [QFN50P300X300X55-16N]  126.01,82.64 270 top
IC21  TPS552882  [RPM0026A-MFG]  95.55,58.12 180 top
IC22  INA219BIDCNT  [SOT23-8]  102.35,89.52 90 top
IC23  STUSB4710AQ1TR  [QFN50P300X300X55-16N]  102.01,82.64 270 top
IC24  TPS552882  [RPM0026A-MFG]  71.55,58.12 180 top
IC25  INA219BIDCNT  [SOT23-8]  78.35,89.52 90 top
IC26  RP2354B  [QFN80-10X10]  106.48,18.03 270 top
IC27  W25Q128JVPIQ  [SON127P600X500X75-8N]  116.04,21.5 270 top
IC28  MCP6001RT-I/OT  [SOT23-5]  112.4,7.4 270 top
IC29  CAT24C256HU4IGT3  [SON50P300X200X50-9T130X140N]  103.99,28.33 0 top
IC30  STUSB4710AQ1TR  [QFN50P300X300X55-16N]  78.02,82.64 270 top
IC31  W5500  [LQFP48]  133.27,24.75 180 top
IC32  TPS552882  [RPM0026A-MFG]  47.55,58.12 180 top
IC33  INA219BIDCNT  [SOT23-8]  54.35,89.52 90 top
IC34  STUSB4710AQ1TR  [QFN50P300X300X55-16N]  54.02,82.64 270 top
IC35  TPS552882  [RPM0026A-MFG]  23.55,58.12 180 top
IC36  INA219BIDCNT  [SOT23-8]  30.34,89.52 90 top
IC37  STUSB4710AQ1TR  [QFN50P300X300X55-16N]  30.01,82.64 270 top
IC38  TCA9548ARGER  [QFN50P400X400X100-25T210N]  52.46,21.76 180 top
IC39  W25Q128JVPIQ  [SON127P600X500X75-8N]  116.05,21.49 270 bottom
IC40  MP2315GJ-Z  [SOT65P280X110-8N]  38.73,5.16 90 top
IC41  MP2315GJ-Z  [SOT65P280X110-8N]  87.08,12.38 90 top
IC42  MCP23017T-E/ML  [QFN28[6X6]ML]  75.3,15.86 270 top
IC43  MP2315GJ-Z  [SOT65P280X110-8N]  75.91,5.17 90 top
J8  691244510006  [691244510006]  8.64,30.42 90 top
JTAG  [3220_10_0300_00]  123.4,11.78 90 top
L1  3.3uH  [0805]  113.75,11.62 180 top
L2  4.7uH 11.3A  [WE-PDHV_1280]  191.19,46.83 90 top
L3  4.7uH 11.3A  [WE-PDHV_1280]  167.09,46.81 90 top
L4  4.7uH 11.3A  [WE-PDHV_1280]  143.08,46.72 90 top
L5  4.7uH 11.3A  [WE-PDHV_1280]  119.11,46.88 90 top
L6  4.7uH 11.3A  [WE-PDHV_1280]  95.09,46.94 90 top
L7  4.7uH 11.3A  [WE-PDHV_1280]  71.1,46.85 90 top
L8  4.7uH 11.3A  [WE-PDHV_1280]  47.08,46.93 90 top
L9  4.7uH 11.3A  [WE-PDHV_1280]  25.2,46.7 90 top
L10  BLM18EG221TN1D  [0603]  134.92,18.69 0 top
L11  4.7uH 3.5A  [SRR5228A]  43.38,5.18 0 top
L12  4.7uH  [SRR5228A]  91.53,12.43 0 top
L13  4.7uH  [SRR5228A]  80.86,5.61 0 top
PORT1  632722100213  [632722100213]  192.8,96.31 180 top
PORT2  632722100213  [632722100213]  168.8,96.3 180 top
PORT3  632722100213  [632722100213]  144.79,96.3 180 top
PORT4  632722100213  [632722100213]  120.8,96.31 180 top
PORT5  632722100213  [632722100213]  96.79,96.31 180 top
PORT6  632722100213  [632722100213]  72.81,96.31 180 top
PORT7  632722100213  [632722100213]  48.79,96.31 180 top
PORT8  632722100213  [632722100213]  24.8,96.31 180 top
R1  10K 1%  [0201]  191,26.55 180 top
R2  1M 1%  [1206]  182.89,15.6 270 bottom
R3  20K 1%  [0201]  198.8,26.58 0 top
R4  10K 1%  [0201]  200.12,26.58 180 top
R5  200K 1%  [0201]  186.14,75.12 180 top
R6  20K 1%  [0201]  170.18,26.45 0 top
R7  10K 1%  [0201]  171.47,26.44 180 top
R8  1M 1%  [1206]  203.17,15.61 270 top
R9  20K 1%  [0201]  178.58,26.4 0 top
R10  10K 1%  [0201]  179.89,26.39 180 top
R11  12.7K 1%  [0201]  184.84,75.13 180 top
R12  1K 1%  [0402]  190.28,28.84 0 top
R13  10K 1%  [0402]  184.37,28.95 90 top
R14  1K 1%  [0402]  190.26,27.65 0 top
R15  1K 1%  [0402]  199.45,28.67 180 top
R16  10K 1%  [0402]  193.48,28.93 90 top
R17  1K 1%  [0402]  199.43,27.53 0 top
R18  1K 1%  [0402]  170.7,27.54 180 top
R19  10K 1%  [0402]  164.76,28.79 90 top
R20  1K 1%  [0402]  170.71,28.87 0 top
R21  1K 1%  [0402]  179.4,28.89 180 top
R22  10K 1%  [0402]  173.44,28.77 90 top
R23  1K 1%  [0402]  179.37,27.59 0 top
R24  10K 1%  [0201]  99.14,15.79 0 top
R25  27R 1%  [0201]  114.29,16.06 180 top
R26  27R 1%  [0201]  114.29,16.77 180 top
R27  33R 1%  [0402]  112.34,14.32 270 bottom
R28  0R 1%  [0402]  110.5,9.63 0 top
R29  0R 1%  [0402]  110.51,10.73 180 top
R30  0R 1%  [0805]  142.45,8.64 90 top
R31  10K 1%  [0402]  134.41,10.03 180 top
R32  10K 1%  [0402]  132.58,9.47 270 top
R33  470R 1%  [0402]  160.37,20.73 0 top
R34  470R 1%  [0402]  145,18.23 270 top
R35  470R 1%  [0402]  142.79,20.5 180 top
R36  1M 1%  [1206]  163.52,4.07 270 top
R37  3.3R 1%  [0201]  141.59,22.6 0 top
R38  3.3R 1%  [0201]  141.6,21.89 0 top
R39  3.3R 1%  [0201]  141.58,24.62 0 top
R40  3.3R 1%  [0201]  141.58,23.9 0 top
R41  49.9R 1%  [0201]  141.57,23.9 180 bottom
R42  49.9R 1%  [0201]  141.57,24.62 180 bottom
R43  49.9R 1%  [0201]  141.58,22.6 0 bottom
R44  49.9R 1%  [0201]  141.59,21.89 0 bottom
R45  12.4K 1%  [R0201]  139.75,26.5 180 top
R46  4.64K 1%  [0201]  184.84,74.39 0 top
R47  4.64K 1%  [0201]  184.84,73.66 180 top
R48  8.87K 1%  [0201]  184.84,72.94 0 top
R49  30.9K 1%  [0201]  184.84,72.22 180 top
R50  1M 1%  [1206]  186.52,95.17 90 top
R51  100K 1%  [0201]  196.23,80.66 180 top
R52  10K 1%  [0402]  187.48,87.95 0 top
R53  10K 1%  [0402]  188.77,82.63 0 top
R54  10K 1%  [0201]  190.32,81.65 180 top
R55  10K 1%  [0402]  191.51,82.64 0 top
R56  200K 1%  [0201]  162.14,75.13 180 top
R57  0.010R 1%  [2512]  192.97,87.62 90 top
R58  0R 1%  [0201]  187.46,59.38 180 top
R59  49.9K 1%  [0201]  196.18,60.41 0 top
R60  20K 1%  [0201]  186.1,58.13 180 top
R61  150K  [R0201]  186.11,58.85 180 top
R62  15K 1%  [0201]  186.12,57.39 180 top
R63  0.010R 1%  [2512]  187.54,70.64 90 top
R64  1R 1%  [0402]  200.18,44.05 0 top
R65  1R 1%  [0402]  196.69,36.85 0 top
R66  12.7K 1%  [0201]  160.84,75.13 180 top
R67  4.64K 1%  [0201]  160.84,74.39 0 top
R68  4.64K 1%  [0201]  160.84,73.66 180 top
R69  8.87K 1%  [0201]  160.84,72.94 0 top
R70  30.9K 1%  [0201]  160.84,72.22 180 top
R71  100K 1%  [0201]  172.23,80.66 180 top
R72  10K 1%  [0402]  163.48,87.95 0 top
R73  10K 1%  [0402]  164.77,82.63 0 top
R74  10K 1%  [0201]  166.32,81.65 180 top
R75  10K 1%  [0402]  167.51,82.64 0 top
R76  0.010R 1%  [2512]  168.97,87.62 90 top
R77  0R 1%  [0201]  163.46,59.38 180 top
R78  49.9K 1%  [0201]  172.18,60.41 0 top
R79  20K 1%  [0201]  162.1,58.13 180 top
R80  150K  [R0201]  162.11,58.85 180 top
R81  15K 1%  [0201]  162.12,57.39 180 top
R82  0.010R 1%  [2512]  163.54,70.63 90 top
R83  1R 1%  [0402]  176.18,44.05 0 top
R84  20K 1%  [0201]  189.64,26.55 0 top
R85  1R 1%  [0402]  172.69,36.85 0 top
R86  0R 1%  [0201]  160.84,70.32 0 top
R87  0R 1%  [0201]  160.84,71.03 0 top
R88  10K 1%  [0201]  172.17,58.11 0 top
R89  1R 1%  [0603]  159.84,41.7 90 top
R90  1R 1%  [0603]  159.86,51.96 270 top
R91  1M 1%  [1206]  162.53,95.17 90 top
R92  200K 1%  [0201]  138.14,75.12 180 top
R93  12.7K 1%  [0201]  136.84,75.13 180 top
R94  4.64K 1%  [0201]  136.84,74.39 0 top
R95  4.64K 1%  [0201]  136.84,73.66 180 top
R96  8.87K 1%  [0201]  136.84,72.94 0 top
R97  30.9K 1%  [0201]  136.84,72.22 180 top
R98  100K 1%  [0201]  148.23,80.66 180 top
R99  10K 1%  [0402]  139.48,87.95 0 top
R100  10K 1%  [0402]  140.77,82.63 0 top
R101  10K 1%  [0201]  142.32,81.65 180 top
R102  10K 1%  [0402]  143.51,82.64 0 top
R103  0.010R 1%  [2512]  144.97,87.63 90 top
R104  0R 1%  [0201]  139.47,59.38 180 top
R105  49.9K 1%  [0201]  148.18,60.4 0 top
R106  20K 1%  [0201]  138.1,58.13 180 top
R107  150K  [R0201]  138.11,58.85 180 top
R108  15K 1%  [0201]  138.12,57.38 180 top
R109  0.010R 1%  [2512]  139.54,70.64 90 top
R110  1R 1%  [0402]  152.18,44.05 0 top
R111  1R 1%  [0402]  148.69,36.85 0 top
R112  0R 1%  [0201]  136.84,70.32 0 top
R113  0R 1%  [0201]  136.84,71.03 0 top
R114  10K 1%  [0201]  148.17,58.11 0 top
R115  1R 1%  [0603]  135.83,41.7 90 top
R116  1R 1%  [0603]  135.86,51.87 270 top
R117  1M 1%  [1206]  138.52,95.17 90 top
R118  200K 1%  [0201]  114.14,75.12 180 top
R119  12.7K 1%  [0201]  112.84,75.13 180 top
R120  4.64K 1%  [0201]  112.84,74.39 0 top
R121  4.64K 1%  [0201]  112.84,73.66 180 top
R122  8.87K 1%  [0201]  112.84,72.94 0 top
R123  30.9K 1%  [0201]  112.84,72.22 180 top
R124  100K 1%  [0201]  124.23,80.65 180 top
R125  10K 1%  [0402]  115.48,87.95 0 top
R126  10K 1%  [0402]  116.77,82.63 0 top
R127  10K 1%  [0201]  118.32,81.65 180 top
R128  10K 1%  [0402]  119.51,82.64 0 top
R129  0.010R 1%  [2512]  120.97,87.62 90 top
R130  0R 1%  [0201]  115.46,59.38 180 top
R131  49.9K 1%  [0201]  124.18,60.41 0 top
R132  20K 1%  [0201]  114.1,58.13 180 top
R133  150K  [R0201]  114.11,58.85 180 top
R134  15K 1%  [0201]  114.12,57.39 180 top
R135  0.010R 1%  [2512]  115.54,70.64 90 top
R136  1R 1%  [0402]  128.18,44.05 0 top
R137  1R 1%  [0402]  124.69,36.84 0 top
R138  0R 1%  [0201]  112.84,70.32 0 top
R139  0R 1%  [0201]  112.84,71.03 0 top
R140  10K 1%  [0201]  124.17,58.11 0 top
R141  1R 1%  [0603]  111.83,41.7 90 top
R142  1R 1%  [0603]  111.83,51.97 270 top
R143  1M 1%  [1206]  114.52,95.17 90 top
R144  200K 1%  [0201]  90.14,75.12 180 top
R145  12.7K 1%  [0201]  88.84,75.13 180 top
R146  4.64K 1%  [0201]  88.84,74.39 0 top
R147  4.64K 1%  [0201]  88.84,73.66 180 top
R148  8.87K 1%  [0201]  88.84,72.94 0 top
R149  30.9K 1%  [0201]  88.84,72.22 180 top
R150  100K 1%  [0201]  100.23,80.66 180 top
R151  10K 1%  [0402]  91.48,87.96 0 top
R152  10K 1%  [0402]  92.77,82.63 0 top
R153  10K 1%  [0201]  94.32,81.66 180 top
R154  10K 1%  [0402]  95.51,82.64 0 top
R155  0.010R 1%  [2512]  96.94,87.67 90 top
R156  0R 1%  [0201]  91.46,59.38 180 top
R157  49.9K 1%  [0201]  100.18,60.41 0 top
R158  20K 1%  [0201]  90.1,58.13 180 top
R159  150K  [R0201]  90.11,58.85 180 top
R160  15K 1%  [0201]  90.12,57.39 180 top
R161  0.010R 1%  [2512]  91.54,70.7 90 top
R162  1R 1%  [0402]  104.18,44.05 0 top
R163  1R 1%  [0402]  100.69,36.85 0 top
R164  0R 1%  [0201]  88.84,70.32 0 top
R165  0R 1%  [0201]  88.84,71.03 0 top
R166  10K 1%  [0201]  100.17,58.11 0 top
R167  1R 1%  [0603]  87.83,41.7 90 top
R168  1R 1%  [0603]  87.76,52.05 270 top
R169  1M 1%  [1206]  90.52,95.17 90 top
R170  200K 1%  [0201]  66.14,75.12 180 top
R171  12.7K 1%  [0201]  64.84,75.13 180 top
R172  4.64K 1%  [0201]  64.84,74.39 0 top
R173  4.64K 1%  [0201]  64.84,73.66 180 top
R174  8.87K 1%  [0201]  64.84,72.94 0 top
R175  30.9K 1%  [0201]  64.84,72.22 180 top
R176  100K 1%  [0201]  76.23,80.66 180 top
R177  10K 1%  [0402]  67.48,87.95 0 top
R178  10K 1%  [0402]  68.77,82.63 0 top
R179  10K 1%  [0201]  70.32,81.65 180 top
R180  10K 1%  [0402]  71.51,82.64 0 top
R181  0.010R 1%  [2512]  72.97,87.62 90 top
R182  0R 1%  [0201]  67.46,59.38 180 top
R183  49.9K 1%  [0201]  76.18,60.41 0 top
R184  20K 1%  [0201]  66.1,58.13 180 top
R185  150K  [R0201]  66.11,58.85 180 top
R186  15K 1%  [0201]  66.12,57.39 180 top
R187  0.010R 1%  [2512]  67.53,70.64 90 top
R188  1R 1%  [0402]  80.18,44.05 0 top
R189  1R 1%  [0402]  76.68,36.85 0 top
R190  0R 1%  [0201]  64.84,70.32 0 top
R191  0R 1%  [0201]  64.84,71.03 0 top
R192  10K 1%  [0201]  76.17,58.11 0 top
R193  1R 1%  [0603]  63.83,41.7 90 top
R194  1R 1%  [0603]  63.83,51.97 270 top
R195  1M 1%  [1206]  66.51,95.17 90 top
R196  200K 1%  [0201]  42.14,75.12 180 top
R197  12.7K 1%  [0201]  40.84,75.13 180 top
R198  4.64K 1%  [0201]  40.84,74.39 0 top
R199  4.64K 1%  [0201]  40.84,73.66 180 top
R200  8.87K 1%  [0201]  40.84,72.94 0 top
R201  30.9K 1%  [0201]  40.84,72.22 180 top
R202  100K 1%  [0201]  52.23,80.66 180 top
R203  10K 1%  [0402]  43.48,87.95 0 top
R204  10K 1%  [0402]  44.77,82.63 0 top
R205  1M 1%  [0201]  125.94,24.75 270 top
R206  4.7K 1%  [0201]  129.59,20.16 270 top
R207  3.3K 1%  [_0603X4-1206]  114.23,27.93 270 top
R208  4.7K 1%  [0201]  131.51,30.44 0 top
R209  DNI  [R0201]  119.78,23.93 270 top
R210  1K 1%  [0201]  119.05,23.93 90 top
R211  1K 1%  [0201]  100.33,17.67 0 top
R212  4.7K 1%  [0201]  114,4.74 270 top
R213  NC  [R0201]  100.84,28.83 270 top
R214  4.7K 1%  [0201]  101.6,28.84 90 top
R215  3.3K 1%  [_0603X4-1206]  57.83,20.99 270 top
R216  3.3K 1%  [_0603X4-1206]  55.41,26.98 0 top
R217  3.3K 1%  [_0603X4-1206]  51.2,26.98 0 top
R218  10K 1%  [0201]  46.32,81.65 180 top
R219  10K 1%  [0402]  47.51,82.64 0 top
R220  0.010R 1%  [2512]  48.96,87.62 90 top
R221  0R 1%  [0201]  43.46,59.38 180 top
R222  49.9K 1%  [0201]  52.18,60.41 0 top
R223  20K 1%  [0201]  42.1,58.13 180 top
R224  150K  [R0201]  42.11,58.85 180 top
R225  4.7K 1%  [0201]  130.01,30.45 0 top
R226  4.7K 1%  [0201]  126.9,26.49 270 top
R227  4.7K 1%  [0201]  127.62,26.49 270 top
R228  0R 1%  [0201]  184.84,70.32 0 top
R229  0R 1%  [0201]  184.84,71.03 0 top
R230  10K 1%  [0201]  196.17,58.11 0 top
R231  1R 1%  [0603]  183.83,41.7 90 top
R232  1R 1%  [0603]  183.83,51.97 270 top
R233  15K 1%  [0201]  42.09,57.38 180 top
R234  0.010R 1%  [2512]  43.54,70.64 90 top
R235  1R 1%  [0402]  56.18,44.05 0 top
R236  1R 1%  [0402]  52.69,36.85 0 top
R237  0R 1%  [0201]  40.84,70.32 0 top
R238  0R 1%  [0201]  40.84,71.03 0 top
R239  10K 1%  [0201]  52.17,58.11 0 top
R240  1R 1%  [0603]  39.83,41.7 90 top
R241  49.9K 1%  [0201]  39.14,8.33 270 top
R242  7.5K 1%  [0201]  37.33,2.35 270 top
R243  10R 1%  [0201]  40.14,8.33 270 top
R244  100K 1%  [0201]  36.56,2.35 90 top
R245  1R 1%  [0603]  39.83,51.97 270 top
R246  1M 1%  [1206]  42.52,95.17 90 top
R247  200K 1%  [0201]  18.14,75.12 180 top
R248  12.7K 1%  [0201]  16.84,75.13 180 top
R249  2.2K 1%  [0201]  136.52,8.59 0 top
R250  5.1K 1%  [0201]  140.01,6.93 180 top
R251  5.1K 1%  [0201]  137.02,7.02 180 top
R252  10K 1%  [0201]  56.43,15.08 180 top
R253  4.64K 1%  [0201]  16.84,74.39 0 top
R254  4.64K 1%  [0201]  16.84,73.66 180 top
R255  1M 1%  [1206]  132.12,3.98 90 top
R256  8.87K 1%  [0201]  16.84,72.94 0 top
R257  30.9K 1%  [0201]  16.84,72.22 180 top
R258  100K 1%  [0201]  28.23,80.66 180 top
R259  10K 1%  [0402]  19.48,87.95 0 top
R260  10K 1%  [0402]  20.77,82.63 0 top
R261  10K 1%  [0201]  22.32,81.65 180 top
R262  10K 1%  [0402]  23.51,82.64 0 top
R263  0.010R 1%  [2512]  24.97,87.62 90 top
R264  0R 1%  [0201]  19.46,59.38 180 top
R265  49.9K 1%  [0201]  28.18,60.41 0 top
R266  20K 1%  [0201]  18.1,58.13 180 top
R267  150K  [R0201]  18.11,58.85 180 top
R268  15K 1%  [0201]  18.12,57.39 180 top
R269  0.010R 1%  [2512]  19.54,70.64 90 top
R270  1R 1%  [0402]  34.26,43.84 0 top
R271  1R 1%  [0402]  30.77,36.64 0 top
R272  0R 1%  [0201]  16.84,70.32 0 top
R273  0R 1%  [0201]  16.84,71.03 0 top
R274  10K 1%  [0201]  28.17,58.11 0 top
R275  1R 1%  [0603]  17.91,41.49 90 top
R276  1R 1%  [0603]  17.91,51.76 270 top
R277  1M 1%  [1206]  18.52,95.17 90 top
R278  DNI  [R0201]  112.86,24.33 0 bottom
R279  0R 1%  [0201]  143.44,21.89 0 top
R280  0R 1%  [0201]  143.44,22.6 0 top
R281  9.09K 1%  [0402]  83.39,11.77 90 top
R282  10R 1%  [0402]  90.27,15.95 180 top
R283  20K 1%  [0402]  84.11,13.91 180 top
R284  40.2K 1%  [0402]  84.55,15.89 270 top
R285  7.5K 1%  [0402]  82.29,14.52 270 top
R286  100K 1%  [0402]  84.6,11.77 270 top
R287  DNI  [0402]  87.84,16.11 270 top
R289  10K 1%  [0402]  84.71,9.68 0 top
R290  9.09K 1%  [0402]  72.94,5.17 180 top
R291  10R 1%  [0402]  78.66,9.02 180 top
R292  20K 1%  [0402]  74.04,7.48 90 top
R293  40.2K 1%  [0402]  72.89,10.01 270 top
R294  7.5K 1%  [0402]  72.89,7.48 270 top
R295  100K 1%  [0402]  72.94,3.96 0 top
R296  DNI  [0402]  76.52,8.86 270 top
R298  10K 1%  [0402]  69.64,3.52 0 top
REF1  LM4040x30  [SOT23]  111.97,3.76 180 top
RFB3  40.2K 1%  [0201]  36.49,7.99 270 top
RFB4  12.7K 1%  [0201]  35.73,6.67 270 top
RT1  33K 1%  [0201]  36.49,6.66 90 top
SW1  B3U-1000P  [B3U-1000P]  118.44,3.27 0 top
SW2  B3U-1000P  [B3U-1000P]  128.3,3.3 180 top
T1  DMP3013SFV  [POWERDI3333-8_UX_DIO-L]  163.8,85.27 90 top
T2  DMP3013SFV  [POWERDI3333-8_UX_DIO-L]  163.76,80.02 180 top
T3  DMP3013SFV  [POWERDI3333-8_UX_DIO-L]  168.87,80.03 0 top
T4  BSZ065N06  [POWERDI3333-8_UX_DIO-L]  176.06,41.19 180 top
T5  BSZ065N06  [POWERDI3333-8_UX_DIO-L]  176,36.21 270 top
T6  DMP3013SFV  [POWERDI3333-8_UX_DIO-L]  187.8,85.27 90 top
T7  DMP3013SFV  [POWERDI3333-8_UX_DIO-L]  187.76,80.02 180 top
T8  DMP3013SFV  [POWERDI3333-8_UX_DIO-L]  192.87,80.02 0 top
T9  BSZ065N06  [POWERDI3333-8_UX_DIO-L]  200.06,41.19 180 top
T10  BSZ065N06  [POWERDI3333-8_UX_DIO-L]  200,36.21 270 top
T11  DMP3013SFV  [POWERDI3333-8_UX_DIO-L]  139.8,85.27 90 top
T12  DMP3013SFV  [POWERDI3333-8_UX_DIO-L]  139.77,80.02 180 top
T13  DMP3013SFV  [POWERDI3333-8_UX_DIO-L]  144.87,80.02 0 top
T14  BSZ065N06  [POWERDI3333-8_UX_DIO-L]  152.05,41.19 180 top
T15  BSZ065N06  [POWERDI3333-8_UX_DIO-L]  152,36.21 270 top
T16  DMP3013SFV  [POWERDI3333-8_UX_DIO-L]  115.81,85.27 90 top
T17  DMP3013SFV  [POWERDI3333-8_UX_DIO-L]  115.76,80.02 180 top
T18  DMP3013SFV  [POWERDI3333-8_UX_DIO-L]  120.86,80.02 0 top
T19  BSZ065N06  [POWERDI3333-8_UX_DIO-L]  128.07,41.19 180 top
T20  BSZ065N06  [POWERDI3333-8_UX_DIO-L]  128,36.21 270 top
T21  DMP3013SFV  [POWERDI3333-8_UX_DIO-L]  91.8,85.28 90 top
T22  DMP3013SFV  [POWERDI3333-8_UX_DIO-L]  91.76,80.02 180 top
T23  DMP3013SFV  [POWERDI3333-8_UX_DIO-L]  96.87,80.02 0 top
T24  BSZ065N06  [POWERDI3333-8_UX_DIO-L]  104.06,41.19 180 top
T25  BSZ065N06  [POWERDI3333-8_UX_DIO-L]  104,36.21 270 top
T26  DMP3013SFV  [POWERDI3333-8_UX_DIO-L]  67.8,85.27 90 top
T27  DMP3013SFV  [POWERDI3333-8_UX_DIO-L]  67.76,80.02 180 top
T28  DMP3013SFV  [POWERDI3333-8_UX_DIO-L]  72.87,80.02 0 top
T29  BSZ065N06  [POWERDI3333-8_UX_DIO-L]  80.06,41.19 180 top
T30  BSZ065N06  [POWERDI3333-8_UX_DIO-L]  80,36.21 270 top
T31  DMP3013SFV  [POWERDI3333-8_UX_DIO-L]  43.8,85.27 90 top
T32  DMP3013SFV  [POWERDI3333-8_UX_DIO-L]  43.76,80.02 180 top
T33  DMP3013SFV  [POWERDI3333-8_UX_DIO-L]  48.87,80.02 0 top
T34  BSZ065N06  [POWERDI3333-8_UX_DIO-L]  56.06,41.19 180 top
T35  BSZ065N06  [POWERDI3333-8_UX_DIO-L]  56,36.21 270 top
T36  DMP3013SFV  [POWERDI3333-8_UX_DIO-L]  19.8,85.27 90 top
T37  DMP3013SFV  [POWERDI3333-8_UX_DIO-L]  19.76,80.02 180 top
T38  DMP3013SFV  [POWERDI3333-8_UX_DIO-L]  24.87,80.02 0 top
T39  BSZ065N06  [POWERDI3333-8_UX_DIO-L]  34.14,40.98 180 top
T40  BSZ065N06  [POWERDI3333-8_UX_DIO-L]  34.08,36 270 top
U$1  DNI  [ROHS_LOGO_0.18_IN]  46.02,10.04 0 top
U$2  DNI  [OSHW-LOGO-L]  65.96,20.11 0 top
U$3  [DMT]  83.36,19.88 0 top
U$4  [DMT]  103.34,45.83 0 bottom
USB9  USB-TYPE-C-018  [USB-C]  138.46,2.42 0 top
USBA_1-2  61400826021  [61400826021]  193.08,7.01 0 top
USBA_3-4  61400826021  [61400826021]  172.76,7.01 0 top
VO3  DNI  [TP-ROUND]  46.17,3.56 0 bottom
VO5A  DNI  [TP-ROUND]  202.79,24.19 270 bottom
VO5B  DNI  [TP-ROUND]  182.49,23.92 270 bottom
VREF  DNI  [TP-ROUND]  109.6,4.17 90 bottom
VUSBA1  TPB1,27  [B1,27]  186.02,23.85 90 bottom
VUSBA2  TPB1,27  [B1,27]  195.15,23.86 90 bottom
VUSBA3  TPB1,27  [B1,27]  166.64,23.7 90 bottom
VUSBA4  TPB1,27  [B1,27]  175.01,23.52 270 bottom
X1  12MHz  [WE-XTAL_CFPX-180]  97.83,18.23 270 top
X2  25MHz  [WE-XTAL_CFPX-180]  123.87,24.77 90 top

## Tracks (layer width: path | path; a pad name or v marks a point on that pad's centre or on a via)
3V3_EN_SYS1
  L1-SIG-HS 0.149: IC40.6 39.14,6.47 R241.2
5V_EN  (via drill 0.2)
  L1-SIG-HS 0.2: R296.2 77.33,9.02 77.33,9.67 77.74,10.08 82.99,10.08 v83.39,9.68
  L1-SIG-HS 0.254: IC43.6 76.23,7.42 v76.3,7.48 76.52,7.7 R296.2
  L1-SIG-HS 0.305: IC41.6 87.4,14.57 v87.52,14.69 87.84,15.02 R287.2 | v83.39,9.68 R289.1
  L3-SIG-LS 0.254: R298.1 70.69,3.52 71.95,4.79 73.98,4.79 74.64,5.45 74.64,7.87 75.03,8.25 75.91,8.25 76.3,7.87 v76.3,7.48
  L3-SIG-LS 0.305: v87.52,14.69 87.52,12.93 86.08,11.49 84.93,11.49 83.39,9.96 v83.39,9.68
  other vias: 68.99,3.52
5VFB
  L1-SIG-HS 0.437: R284.2 C295.2 83.44,15.12 | 83.44,15.12 83.44,13.93 arc90 R283.2 | R285.1 83.4,15.17 arc-90 83.44,15.12
5VFB1
  L1-SIG-HS 0.254: C302.2 R293.2 R294.1 R292.2
24VINA  (via drill 0.35)
  other vias: 3,46 5,46 3,44 3,42 3,40 3,38 3,36 3,34 3,32 3,30 3,28 3,26 3,24 3,22 5,22 5,24 7,24 7,22 5,26 5,28 5,30 5,32 5,34 5,36 5,38 5,40 5,42 5,44 7,46
  pour L1-SIG-HS (isolate 0.203, no thermals): 10.4,25.4 6.8,25.4 5.6,26.6 5.6,43.4 8.2,46 8.2,51.6 8,51.8 2,51.8 2,21.6 2.8,20.8 10.8,20.8 10.8,25
  pour L4-PWR (isolate 0.203, no thermals): 10.4,25.4 6.8,25.4 5.6,26.6 5.6,43.4 8.2,46 8.2,51.6 8,51.8 2,51.8 2,21.6 2.8,20.8 10.8,20.8 10.8,25
  pour L6-SIG-HS (isolate 0.203, no thermals): 10.4,25.4 6.8,25.4 5.6,26.6 5.6,43.4 8.2,46 8.2,51.6 8,51.8 2,51.8 2,21.6 2.8,20.8 10.8,20.8 10.8,25
24VINB  (via drill 0.35)
  other vias: 7,30 9,30 11,30 11,28 7,28 11,26 13,26 13,28 15,26 15,24 13,24 13,22 15,22 17,22 19,22 21,22 23,22 19,26 13,30 15,28
  pour L1-SIG-HS (isolate 0.203, no thermals): 6.8,30.4 12.6,30.4 16,27 23,27 23,20.8 11.8,20.8 11.8,25.2 10.8,26.2 7.2,26.2 6.4,27 6.4,30
  pour L4-PWR (isolate 0.203, no thermals): 6.8,30.4 12.6,30.4 16,27 23,27 23,20.8 11.8,20.8 11.8,25.2 10.8,26.2 7.2,26.2 6.4,27 6.4,30
  pour L6-SIG-HS (isolate 0.203, no thermals): 6.8,30.4 12.6,30.4 16,27 23,27 23,20.8 11.8,20.8 11.8,25.2 10.8,26.2 7.2,26.2 6.4,27 6.4,30
24VINC  (via drill 0.35)
  other vias: 3,20 5,20 5,18 3,18 3,16 5,16 7,16 7,18 7,20 9,20 11,20 13,20 11,18 9,16 11,16 13,16 13,18 15,18 15,20 15,16 17,16 19,16 21,16 23,16 23,18 23,20 19,20 17,20 21,20
  pour L1-SIG-HS (isolate 0.203, no thermals): 3.2,20 23,20 23,15.6 3.2,15.6
  pour L4-PWR (isolate 0.203, no thermals): 3.2,20 23,20 23,15.6 3.2,15.6
  pour L6-SIG-HS (isolate 0.203, no thermals): 3.2,20 23,20 23,15.6 3.2,15.6
!ACT  (via drill 0.2)
  L1-SIG-HS 0.149: v144.33,19.89 144.33,19.55 R34.1 | v130.61,26.61 130.5,26.5 130.46,26.5 130.45,26.51 130.09,26.51 130.08,26.5 IC31.27
  L3-SIG-LS 0.149: v144.33,19.89 143.01,19.89 140.26,22.64 137.89,22.64 136.13,24.4 131.86,24.4 130.83,25.43 130.83,26.39 v130.61,26.61
!DUP
  L1-SIG-HS 0.149: IC31.26 127.85,27 R227.1
!LINK  (via drill 0.2)
  L1-SIG-HS 0.149: IC31.25 130.43,27.5 v130.57,27.36 | 159.72,20.37 R33.1 159.67,20.78 v159.67,21.69
  L3-SIG-LS 0.149: v130.57,27.36 131.07,26.86 137.55,26.86 138.36,26.05 140.78,26.05 | 140.78,26.05 | 140.78,26.05 143.54,26.05 v143.83,26.34
  L6-SIG-HS 0.149: v143.83,26.34 146.44,26.34 147.54,25.24 158.98,25.24 159.67,24.55 v159.67,21.69
!QSPI_SS  (via drill 0.2)
  L1-SIG-HS 0.149: IC26.75 112.38,19.83 112.83,20.28 112.83,25.23 113.36,25.76 115.41,25.76 115.87,25.3 v117.34,25.3 117.94,24.7 IC27.1 118.09,24.2 R210.2 R209.1
!SPD
  L1-SIG-HS 0.149: R226.1 126.9,27.25 127.63,27.98 130.21,27.98 130.52,28.29 IC31.24
!W5500_CS  (via drill 0.2)
  L1-SIG-HS 0.149: IC31.32 126.53,24 v126.23,23.7 | IC26.17 103.88,24.3 103.75,24.43 v103.75,25.53
  L3-SIG-LS 0.149: v126.23,23.7 121.55,23.7 118.79,26.46 113.03,26.46 112.1,25.53 v103.75,25.53
!W5500_INT  (via drill 0.2)
  L1-SIG-HS 0.149: IC31.36 127.95,22 v127.83,21.88 | IC26.21 101.53,23.52 v101.96,23.95
  L3-SIG-LS 0.149: v127.83,21.88 124.65,21.88 124.32,21.55 120.32,21.55 119.15,22.72 119.15,24.05 119.17,24.07 118.74,24.5 116.98,24.5 116.33,25.15 113.57,25.15 112.64,24.22 104.78,24.22 104.54,23.98 101.99,23.98 v101.96,23.95
!W5500_RST  (via drill 0.2)
  L1-SIG-HS 0.149: IC31.37 129.72,20.57 R206.1 128.91,20.43 v128.89,20.46 | IC26.20 102.66,22.98 v102.22,23.42
  L3-SIG-LS 0.149: v128.89,20.46 127.91,21.44 127.65,21.44 127.53,21.55 124.79,21.55 124.46,21.23 120.18,21.23 118.82,22.59 118.82,23.86 118.51,24.18 116.85,24.18 116.2,24.83 113.71,24.83 112.78,23.9 104.91,23.9 104.67,23.66 102.45,23.66 v102.22,23.42
+1V1  (via drill 0.2)
  L1-SIG-HS 0.149: IC26.10 v106.68,22.29 | IC26.32 v102.33,17.43 | IC26.51 106.68,13.72 v106.82,13.86 | IC26.69 111.43,17.24 IC26.68 | v110.66,16.2 110.77,16.09 110.77,16.08 111.02,15.83 IC26.65 | L1.2 v112.8,10.44 v112.81,10.43 | L1.2 112.24,11.06 v112.24,10.43 | L1.2 113.38,11.04 v113.38,10.43
  L1-SIG-HS 0.203: 111.17,17.22 111.22,17.22 IC26.69 111.5,17.36 111.5,17.1 IC26.68 111.16,17.03 111.13,17.07 111.13,17.42
  L1-SIG-HS 0.254: 111.43,17.24 111.41,17.22 111.17,17.22 v110.64,17.22
  L4-PWR 0.254: 107.5,13.86 v106.82,13.86 106.43,14.25 106.43,15.35 105.87,15.91 102.89,15.91 102.33,16.47 v102.33,17.43 103.24,18.34 103.24,21.06 103.59,21.41 105.8,21.41 v106.68,22.29 | 107.5,13.86 108.52,14.88 108.52,16.93 108.81,17.22 v110.64,17.22 110.64,16.22 v110.66,16.2 | v113.38,10.43 v112.81,10.43 v112.24,10.43 108.78,10.43 107.5,11.71 107.5,13.86
  L6-SIG-HS 0.149: C27.1 110.19,16.23 | C27.1 110.19,16.2 v110.66,16.2 | C27.1 110.17,17.09 110.07,17.2 | C194.1 v106.82,13.86 | C193.1 v102.33,17.43
  L6-SIG-HS 0.152: C192.1 v106.68,22.29
  L6-SIG-HS 0.203: C26.1 110.07,17.2 110.62,17.2 v110.64,17.22
+3V3  (via drill 0.2)